# EAGLE design Cypher - V0.3.1 (EAGLE 9.0.1)
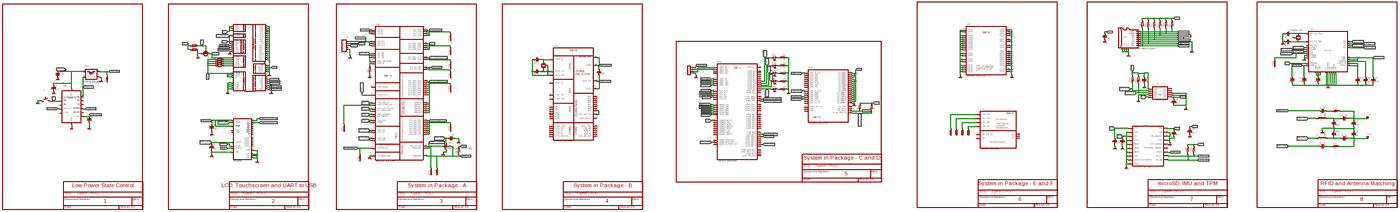
[diagram p0: schematic, sheet 1, overview]
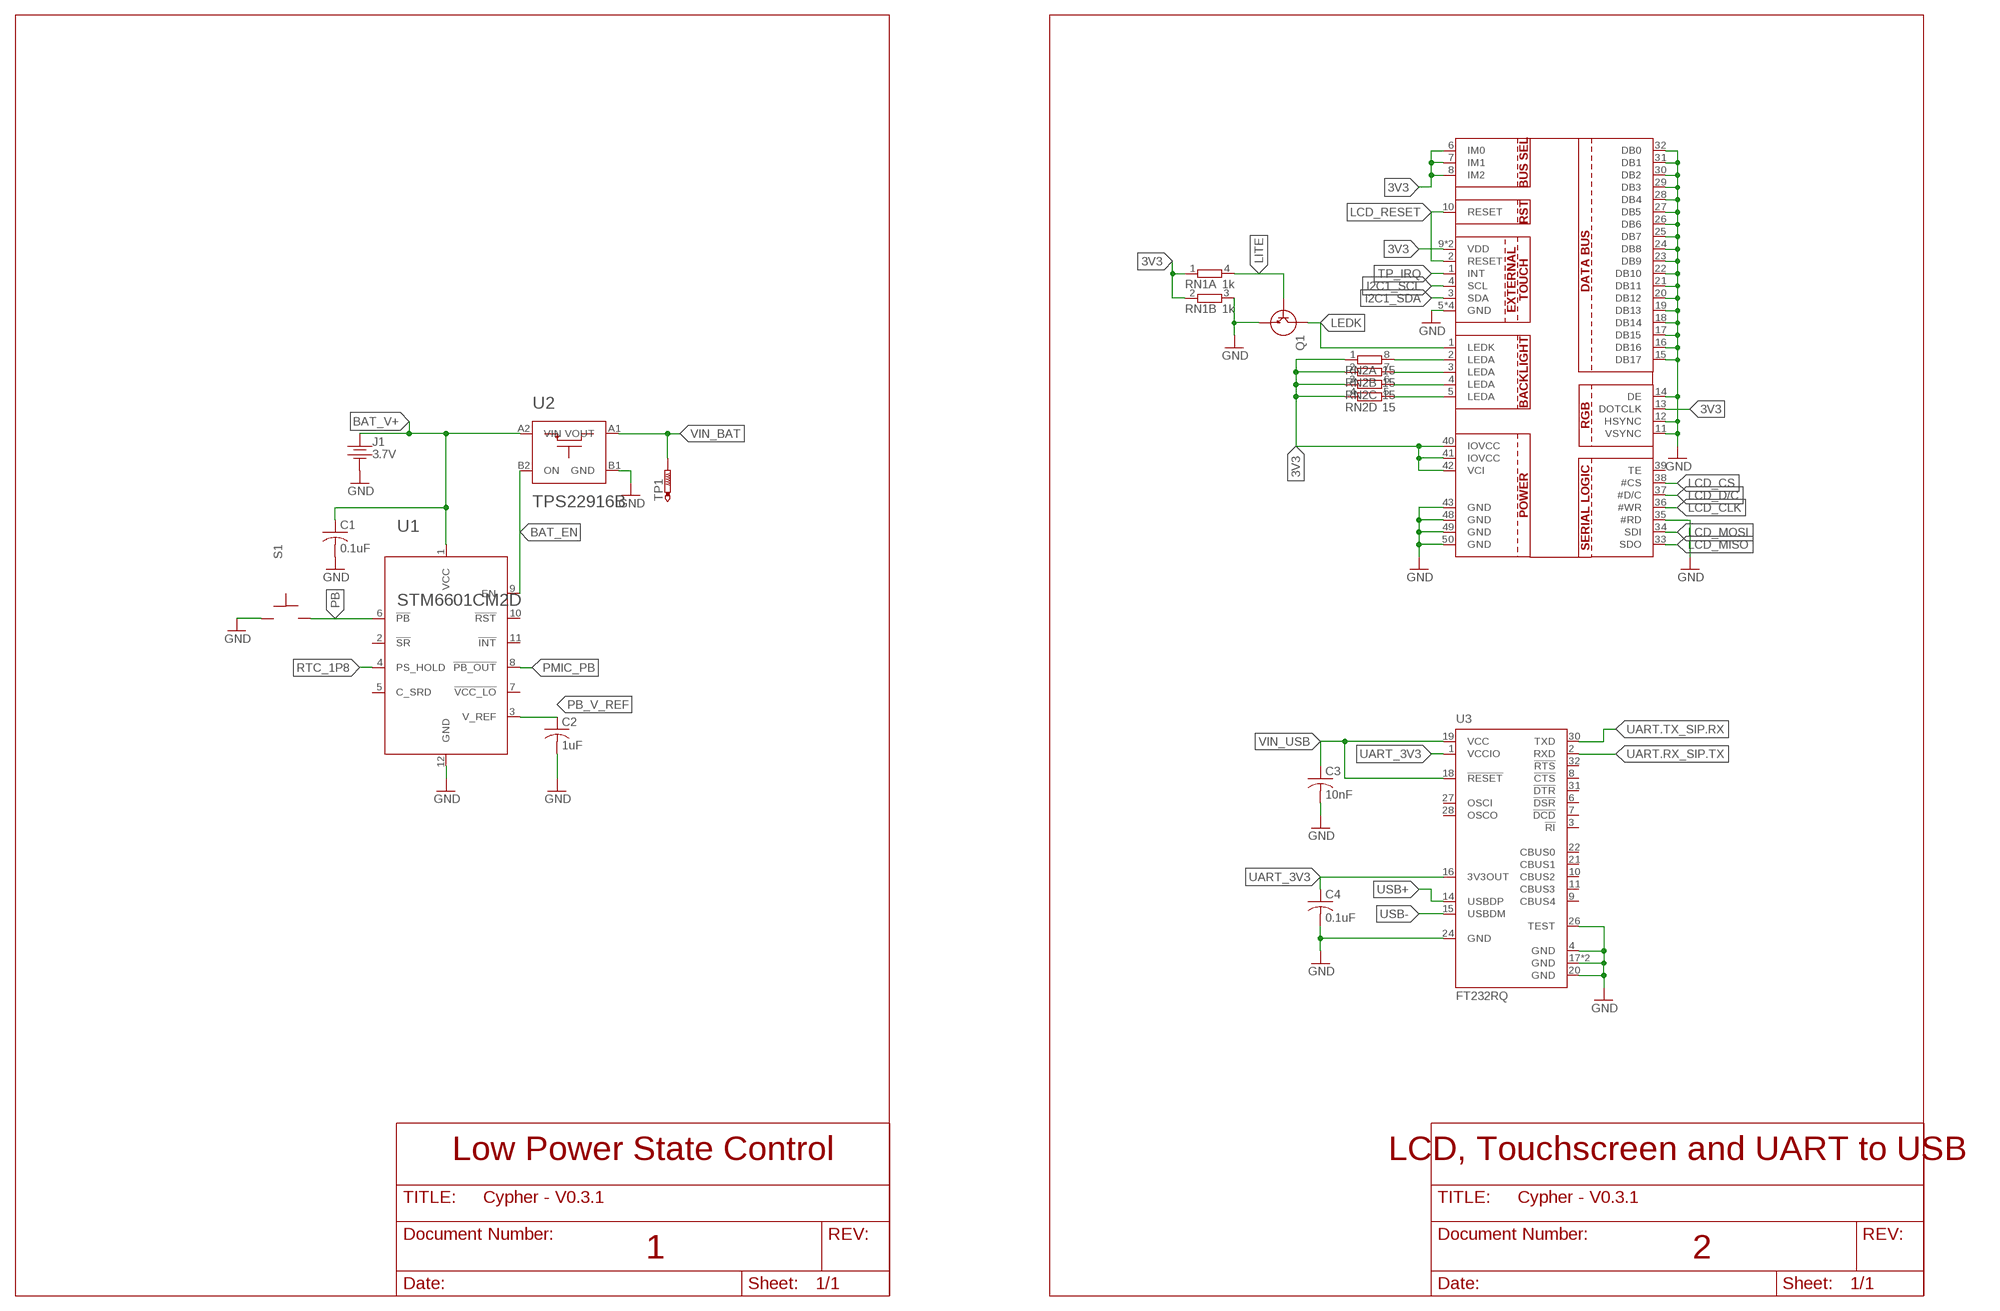
[diagram p1: schematic, sheet 1, part 1 of 5]
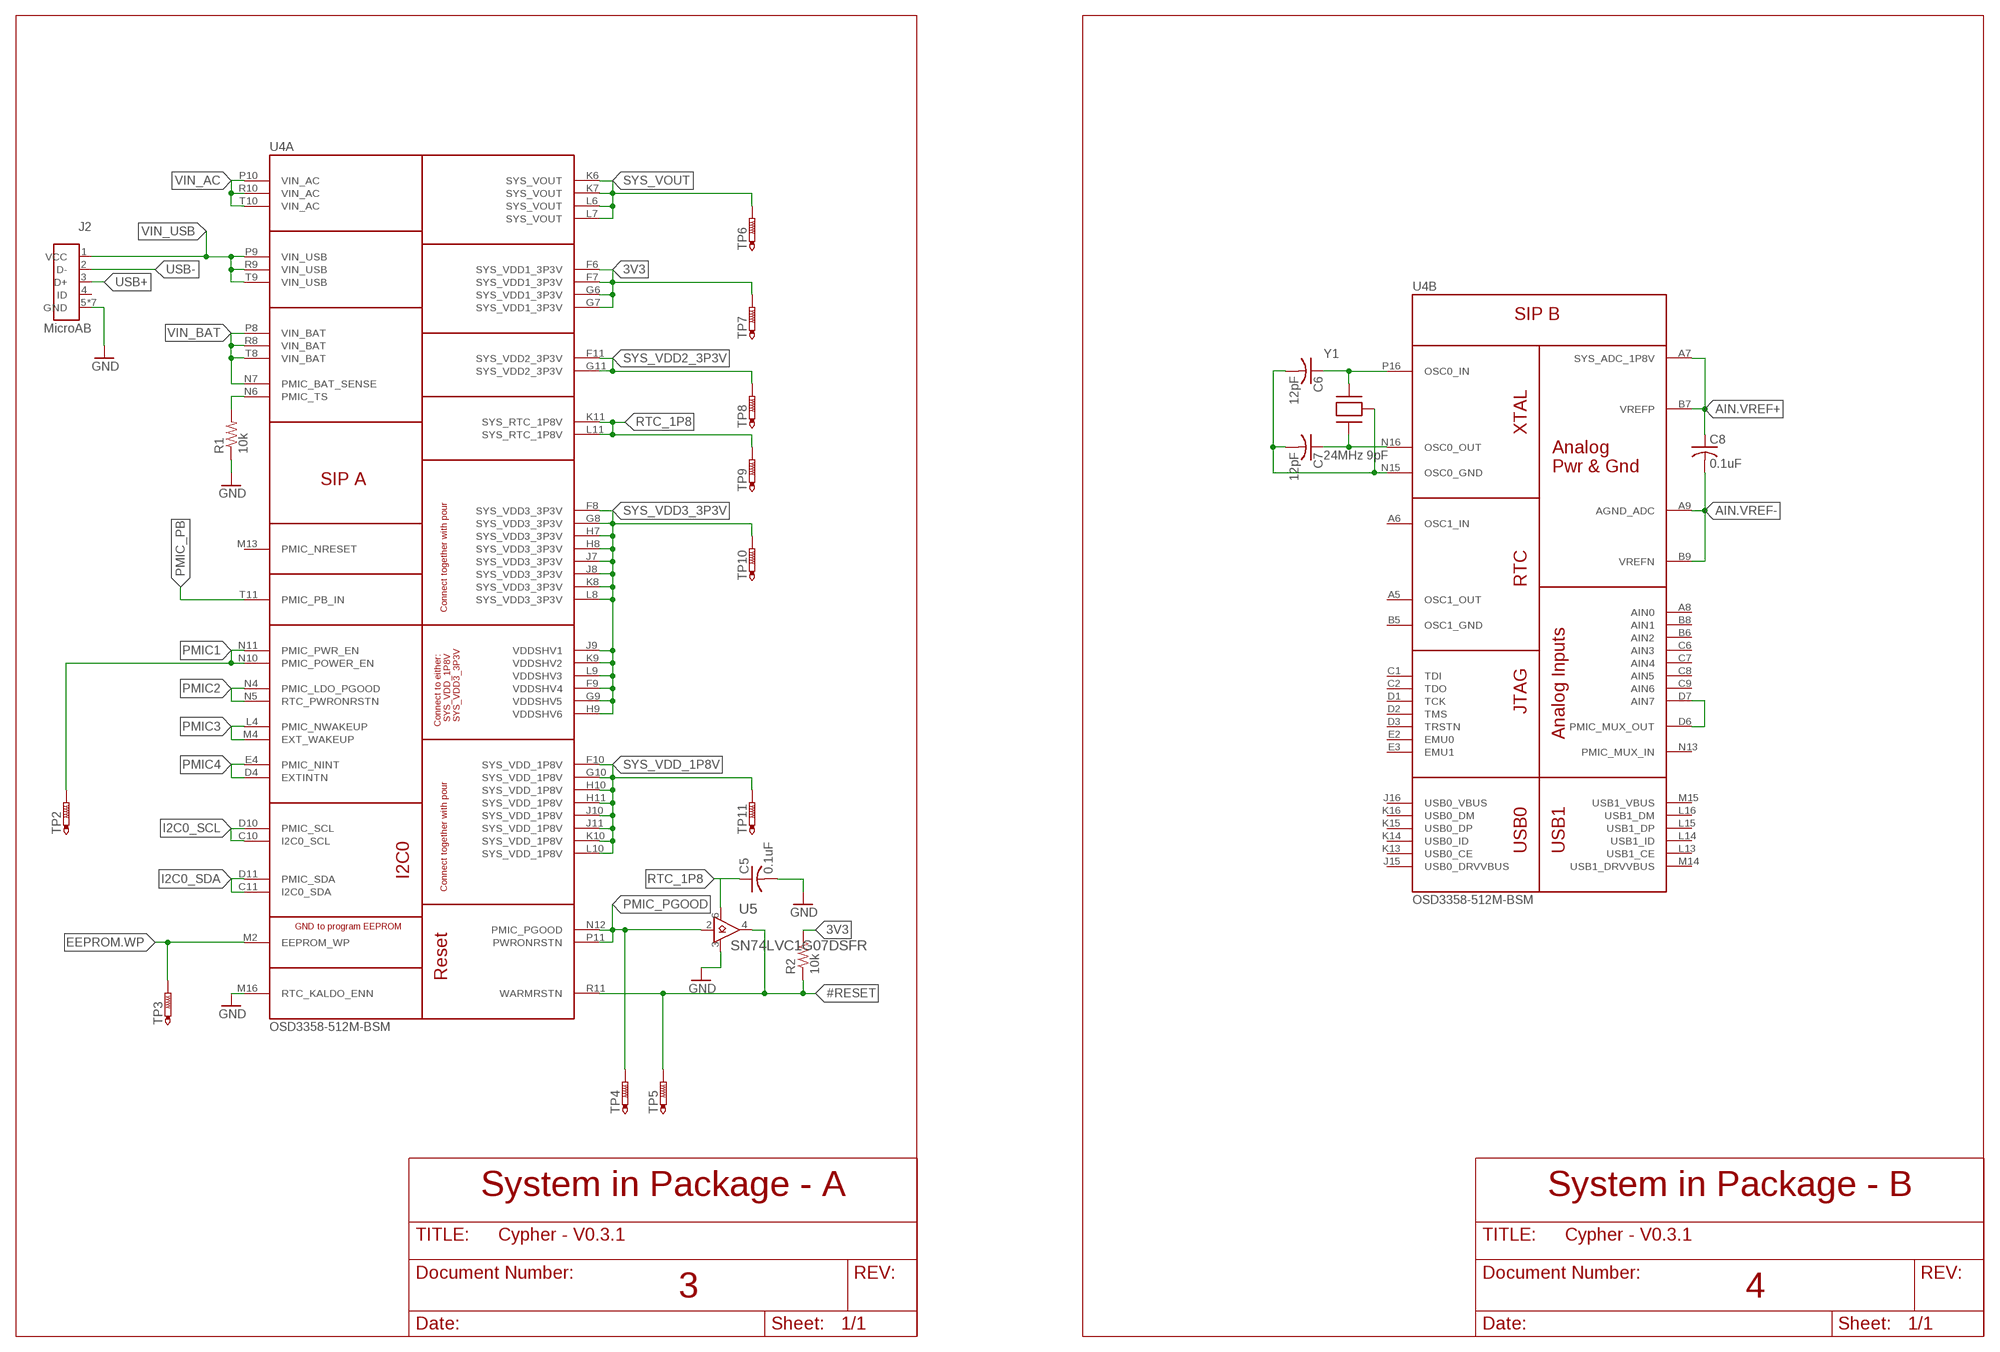
[diagram p2: schematic, sheet 1, part 2 of 5]
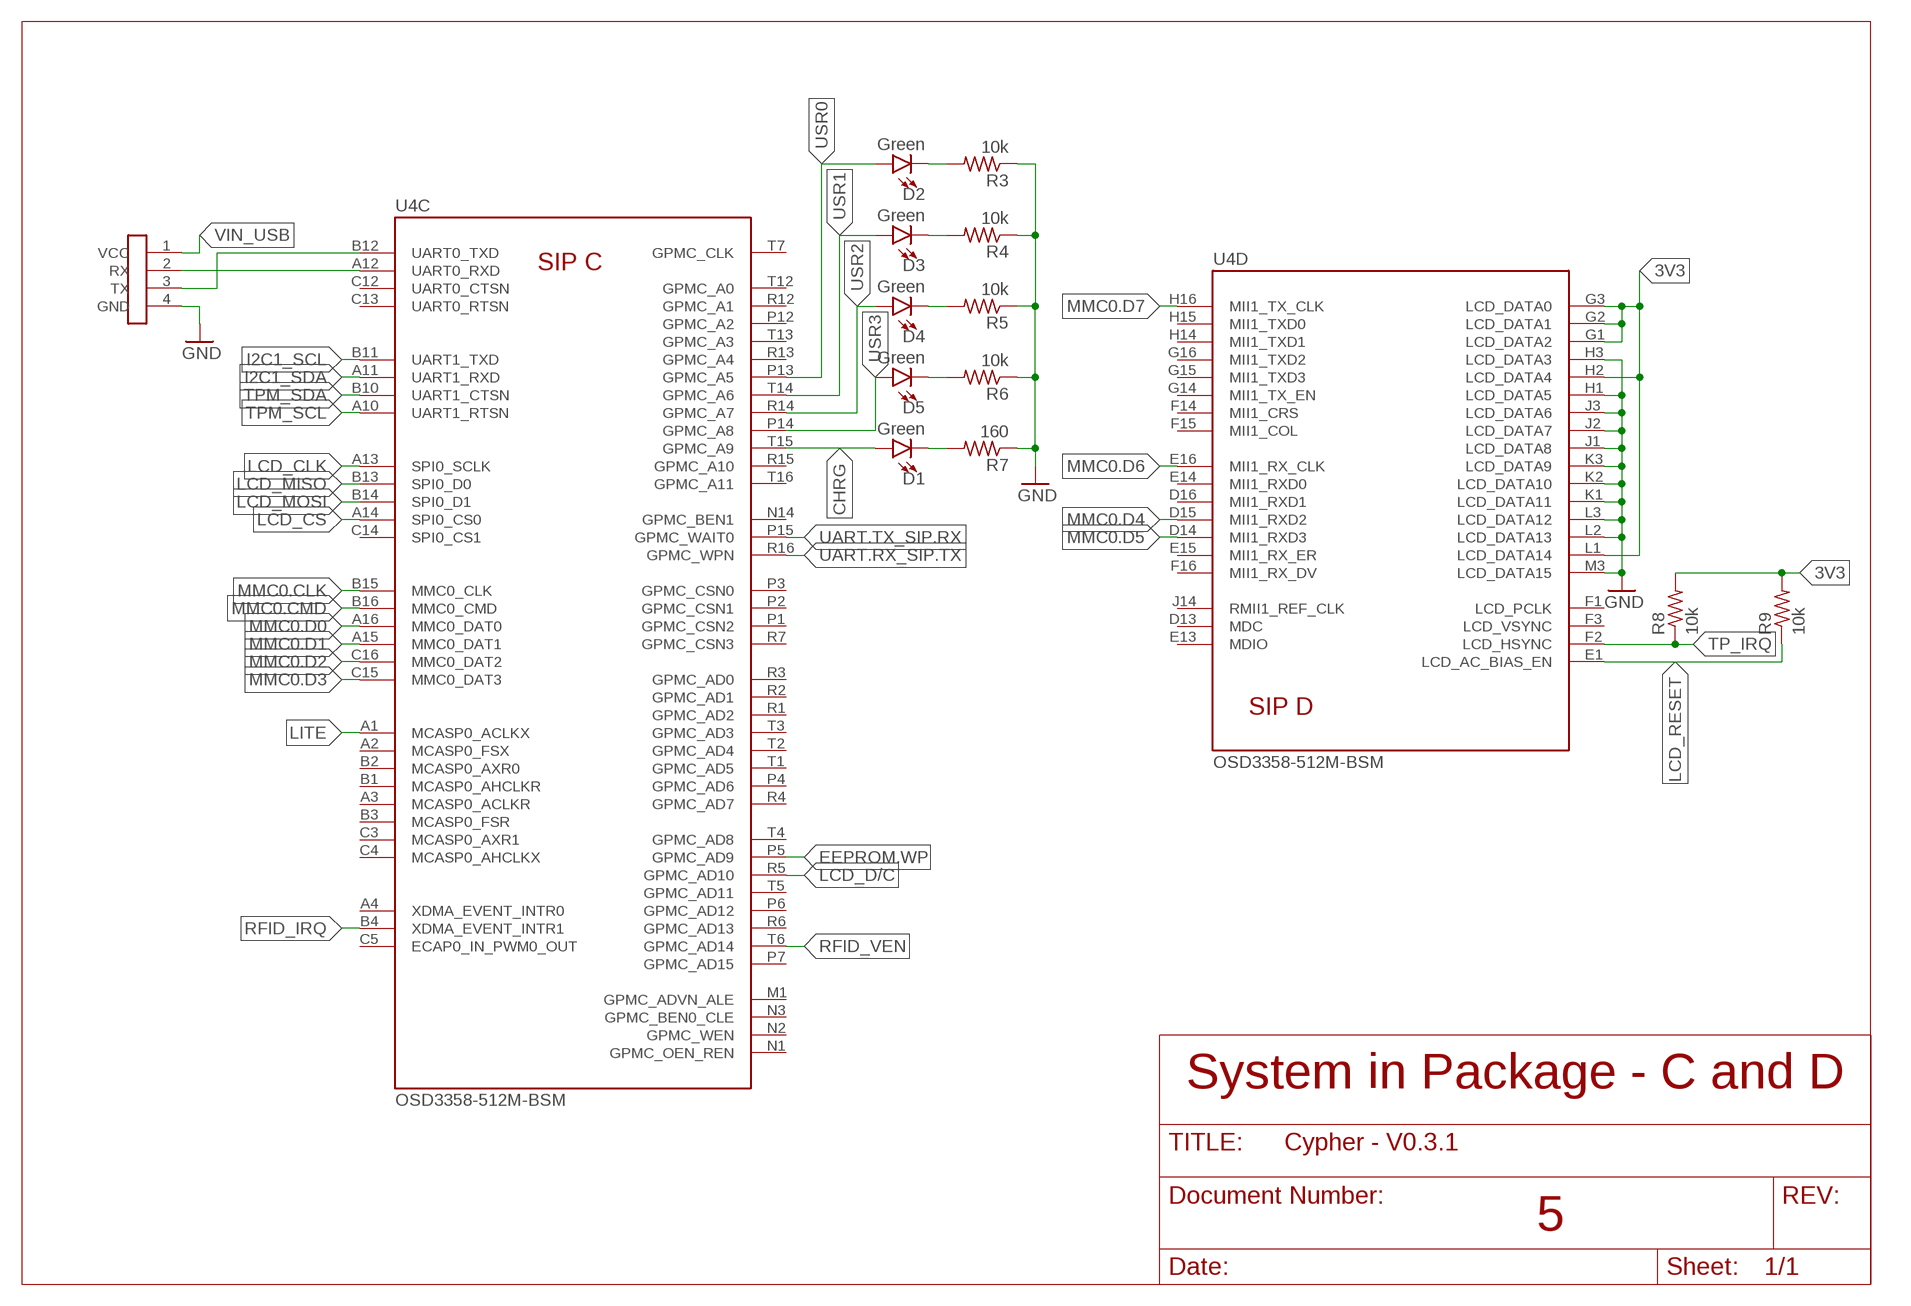
[diagram p3: schematic, sheet 1, part 3 of 5]
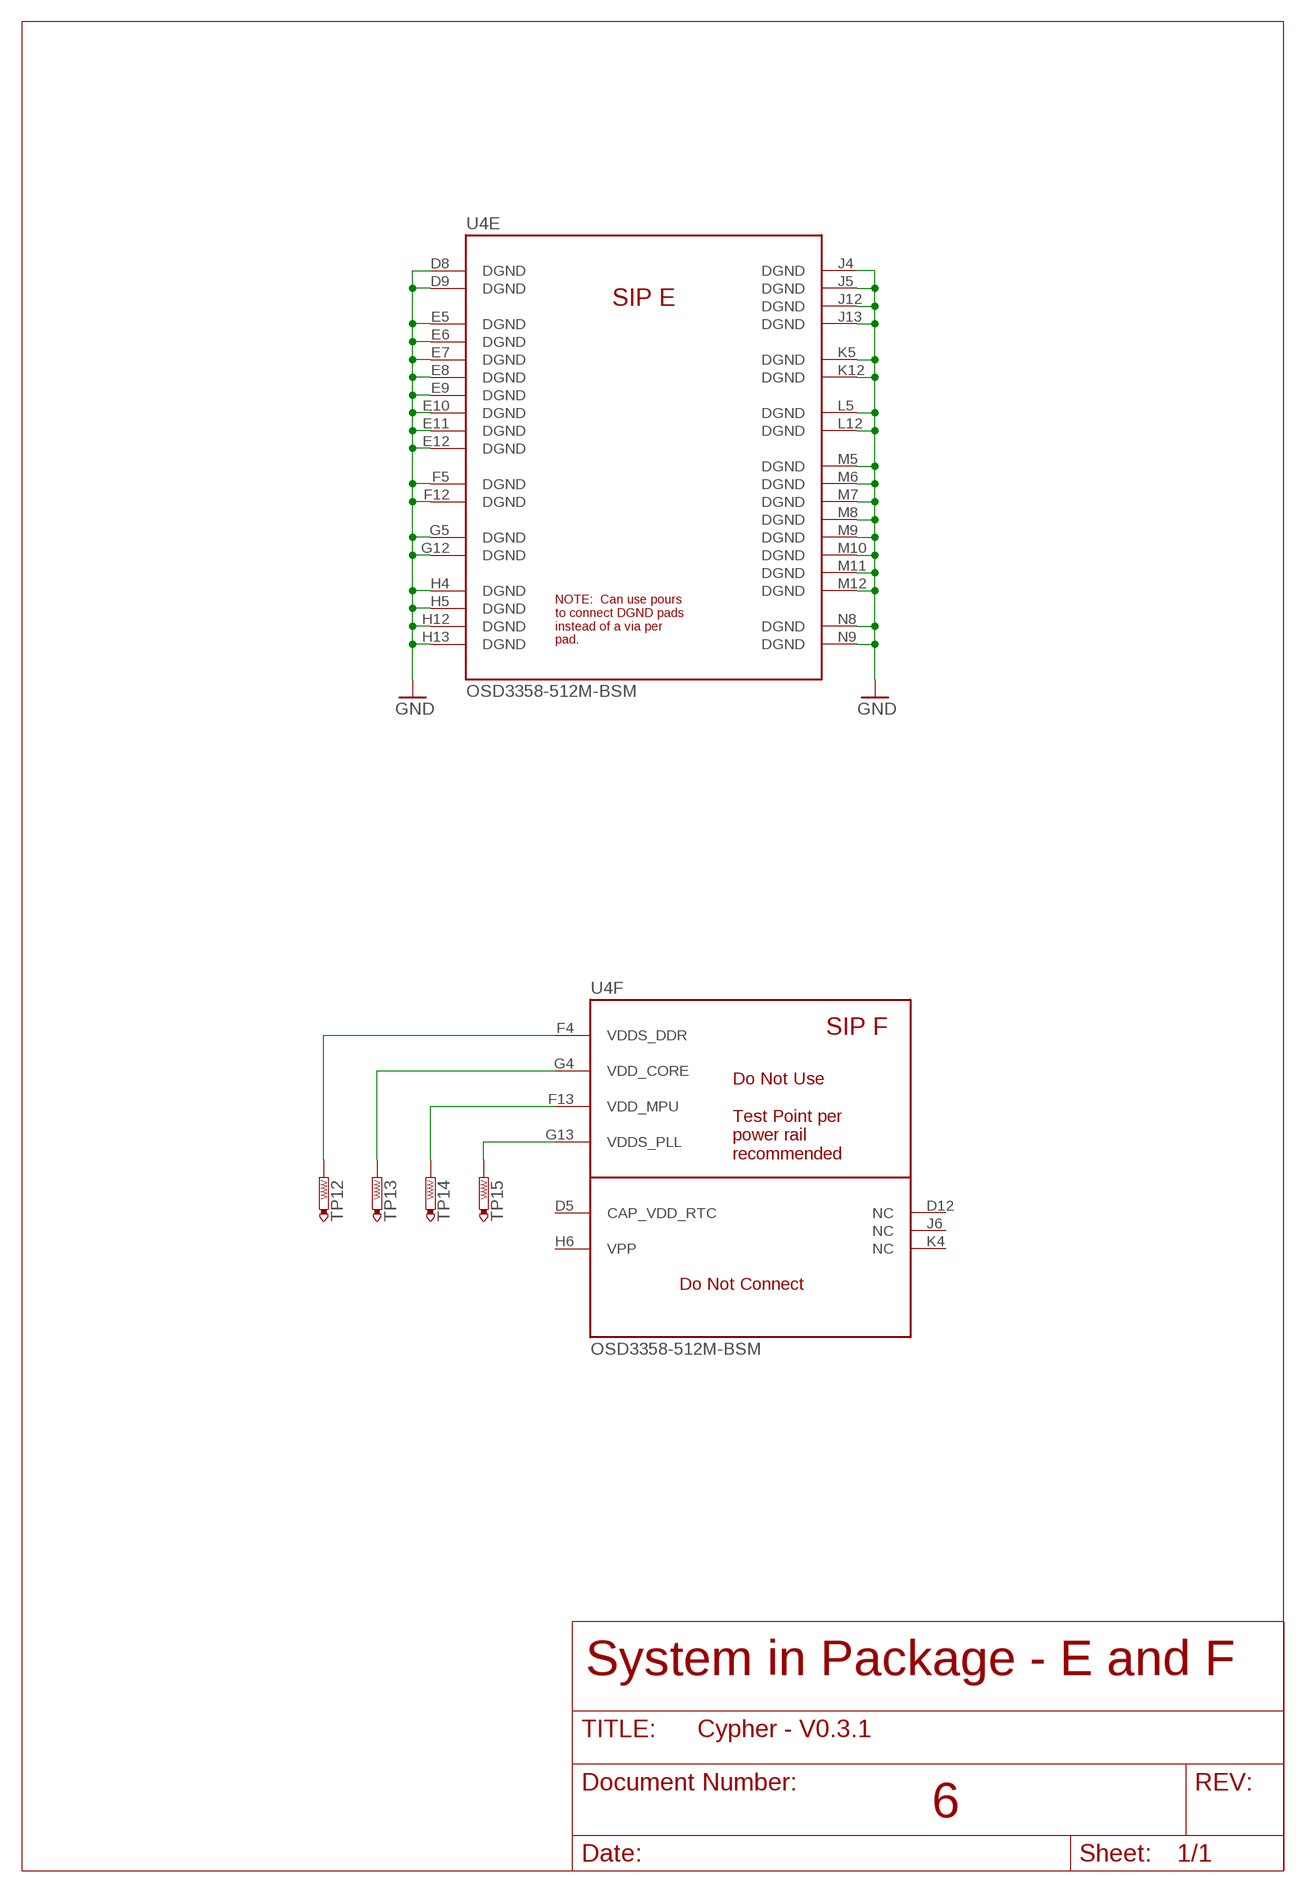
[diagram p4: schematic, sheet 1, part 4 of 5]
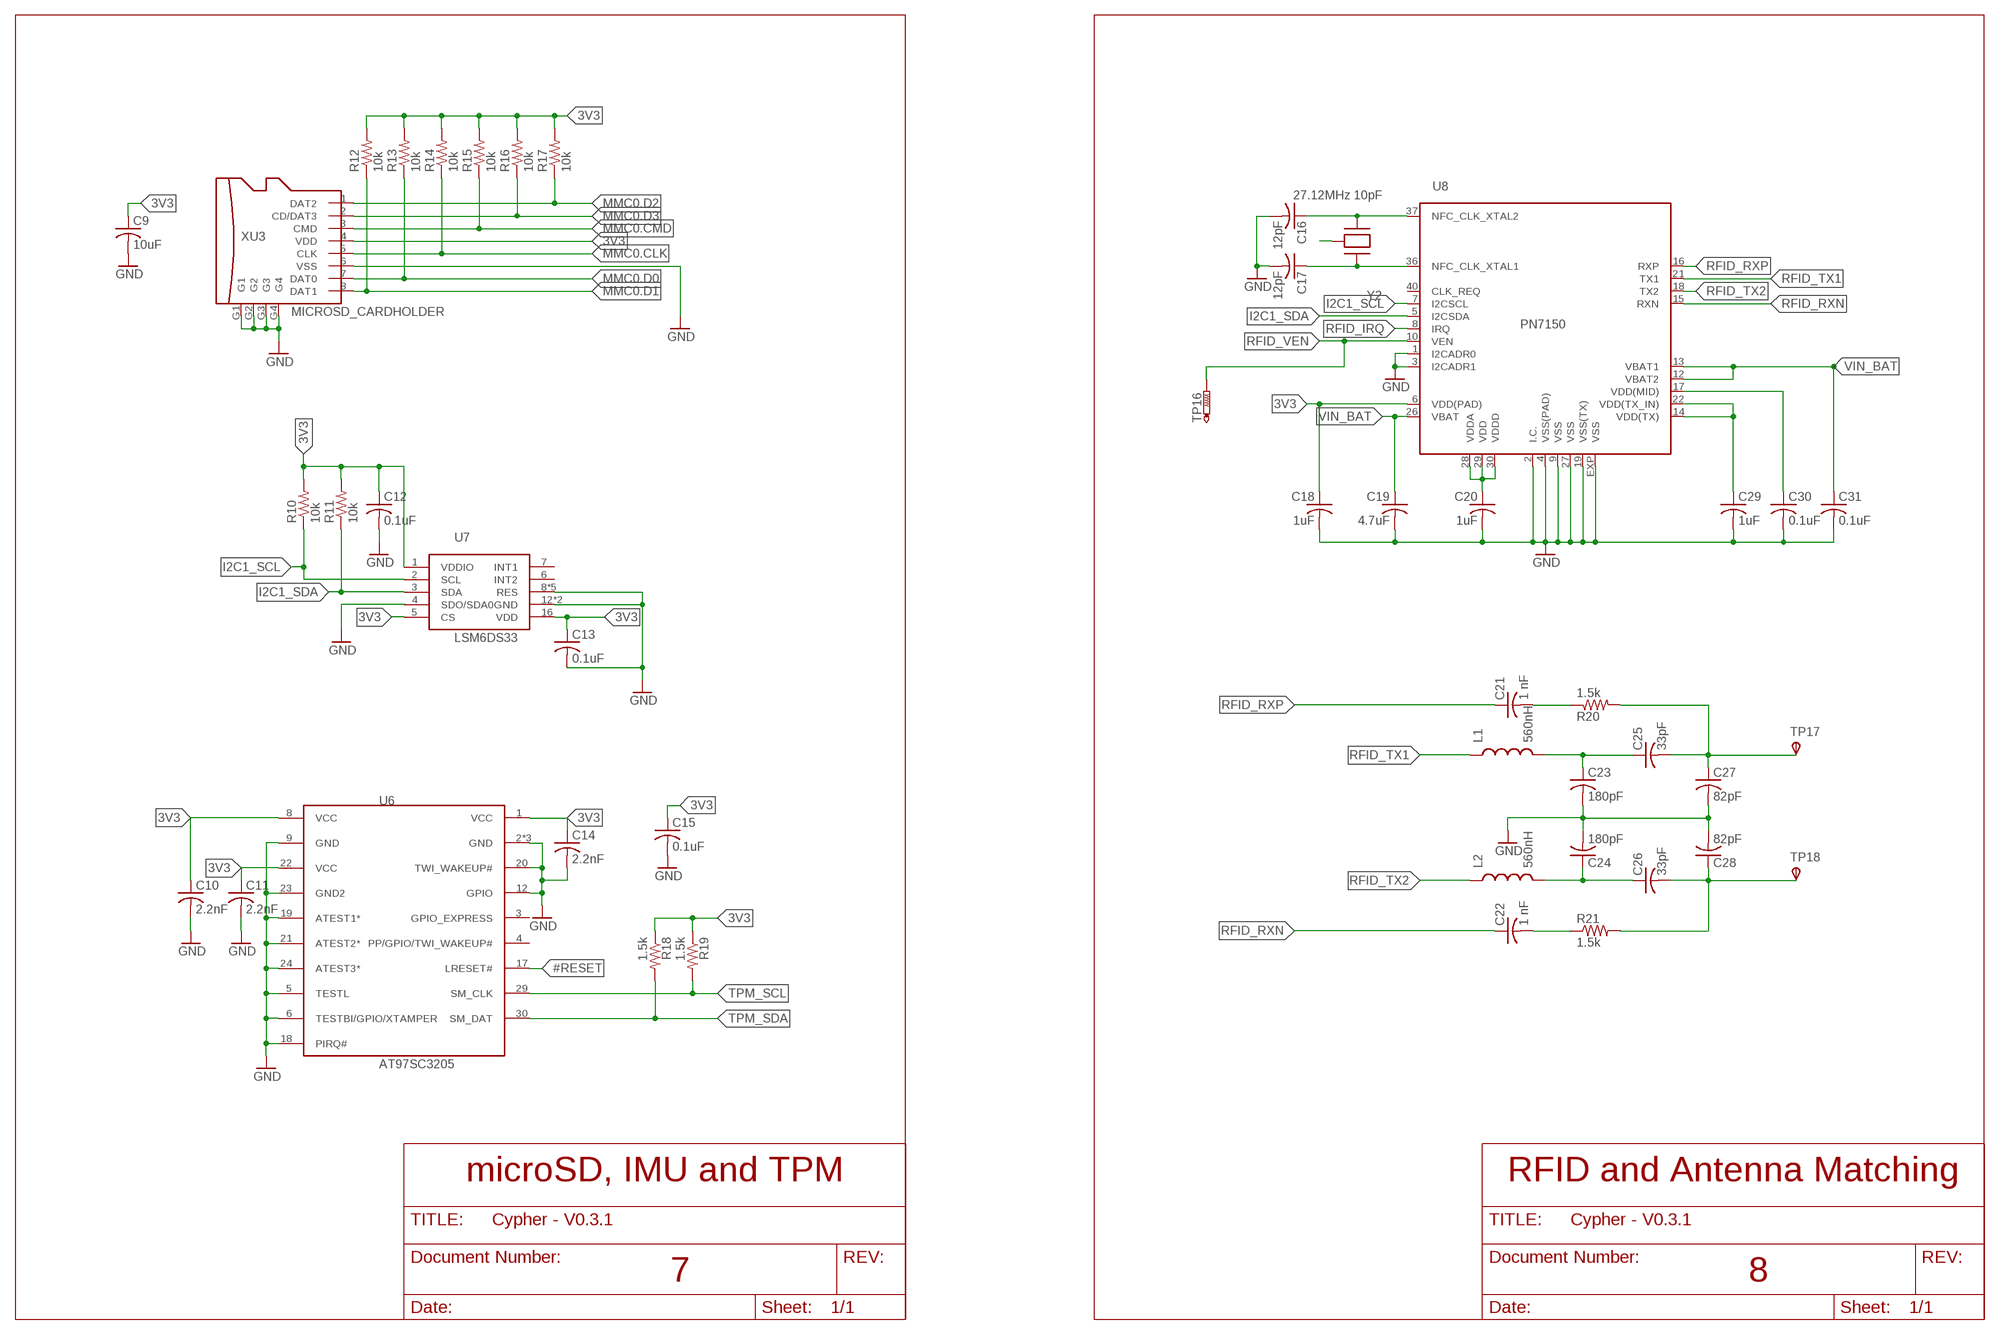
[diagram p5: schematic, sheet 1, part 5 of 5]

## Parts
C1  0.1uF  C-USC0402  [C0402]
C2  1uF  C-USC0402  [C0402]
C3  10nF  C-USC0402  [C0402]
C4  0.1uF  C-USC0402  [C0402]
C5  0.1uF  C-USC0402  [C0402]
C6  12pF  C-USC0402  [C0402]
C7  12pF  C-USC0402  [C0402]
C8  0.1uF  C-USC0402  [C0402]
C9  10uF  C-USC0402  [C0402]
C10  2.2nF  C-USC0402  [C0402]
C11  2.2nF  C-USC0402  [C0402]
C12  0.1uF  C-USC0402  [C0402]
C13  0.1uF  C-USC0402  [C0402]
C14  2.2nF  C-USC0402  [C0402]
C15  0.1uF  C-USC0402  [C0402]
C16  12pF  C-USC0402  [C0402]
C17  12pF  C-USC0402  [C0402]
C18  1uF  C-USC0402  [C0402]
C19  4.7uF  C-USC0402  [C0402]
C20  1uF  C-USC0402  [C0402]
C21  1 nF  C-USC0603  [C0603]
C22  1 nF  C-USC0603  [C0603]
C23  180pF  C-USC0402  [C0402]
C24  180pF  C-USC0402  [C0402]
C25  33pF  C-USC0402  [C0402]
C26  33pF  C-USC0402  [C0402]
C27  82pF  C-USC0402  [C0402]
C28  82pF  C-USC0402  [C0402]
C29  1uF  C-USC0402  [C0402]
C30  0.1uF  C-USC0402  [C0402]
C31  0.1uF  C-USC0402  [C0402]
D1  Green  LED0603  [LED-0603]
D2  Green  LED0603  [LED-0603]
D3  Green  LED0603  [LED-0603]
D4  Green  LED0603  [LED-0603]
D5  Green  LED0603  [LED-0603]
J1  3.7V  SH-CONNECTOR  [SH_CONNECTOR]
J2  MicroAB  MICRO_USB_AB_SMD  [MICRO-USB-AB-SMD]
J3  UARTPINSSH  [SM04B-SRSS-TB]
L1  560nH  INDUCTOR0402  [C0402]
L2  560nH  INDUCTOR0402  [C0402]
Q1  MMBT2222ASOT23  [SOT-23-3]
R1  10k  R-US_R0402  [R0402]
R2  10k  R-US_R0402  [R0402]
R3  10k  R-US_R0402  [R0402]
R4  10k  R-US_R0402  [R0402]
R5  10k  R-US_R0402  [R0402]
R6  10k  R-US_R0402  [R0402]
R7  160  R-US_R0402  [R0402]
R8  10k  R-US_R0402  [R0402]
R9  10k  R-US_R0402  [R0402]
R10  10k  R-US_R0402  [R0402]
R11  10k  R-US_R0402  [R0402]
R12  10k  R-US_R0402  [R0402]
R13  10k  R-US_R0402  [R0402]
R14  10k  R-US_R0402  [R0402]
R15  10k  R-US_R0402  [R0402]
R16  10k  R-US_R0402  [R0402]
R17  10k  R-US_R0402  [R0402]
R18  1.5k  R-US_R0402  [R0402]
R19  1.5k  R-US_R0402  [R0402]
R20  1.5k  R-US_R0402  [R0402]
R21  1.5k  R-US_R0402  [R0402]
RN1  1k  2R-NEXBV4V  [EXBV4V]
RN2  15  4R-NEXBN8V  [EXBN8V]
S1  PUSHBUTTON1.2  [EVQ-PUK]
TP1  PTR1B1,27  [B1,27]
TP2  PTR1B1,27  [B1,27]
TP3  PTR1B1,27  [B1,27]
TP4  PTR1B1,27  [B1,27]
TP5  PTR1B1,27  [B1,27]
TP6  PTR1B1,27  [B1,27]
TP7  PTR1B1,27  [B1,27]
TP8  PTR1B1,27  [B1,27]
TP9  PTR1B1,27  [B1,27]
TP10  PTR1B1,27  [B1,27]
TP11  PTR1B1,27  [B1,27]
TP12  PTR1B1,27  [B1,27]
TP13  PTR1B1,27  [B1,27]
TP14  PTR1B1,27  [B1,27]
TP15  PTR1B1,27  [B1,27]
TP16  PTR1B1,27  [B1,27]
TP17  TPSB2,54  [B2,54]
TP18  TPSB2,54  [B2,54]
U1  STM6601CM2D  STM660  [TDFN12]
U2  TPS22916B  [WSON-4PIN]
U3  FT232RQ  [QFN32]
U4  OSD3358-512M-BSM  [OSD335X-BGA-256]
U5  SN74LVC1G07DSFR  [SON35P100X100X40-6N]
U6  AT97SC3205  [QFN32-4MM]
U7  LSM6DS33  [LGA-16]
U8  PN7150  [HVQFN40]
XU1  CAPTOUCHSCREEN_6PINFPC10PIN  [DF37NB-10DS-0.4V]
XU2  ILI9388_50PIN_SOCKET  [FPC/FFC_50PIN_0.5MMPITCH]
XU3  MICROSD_CARDHOLDER  [HINGED_LID_MICROSD]
Y1  24MHz 9pF  TSX-3225  [4-SMD]
Y2  27.12MHz 10pF  CRISTAL_XRCGB  [XRCGB]

## Nets
3V3: C9.1 C10.1 C11.1 C12.1 C13.1 C14.1 C15.1 C18.1 R2.2 R8.2 R9.2 R10.2 R11.2 R12.2 R13.2 R14.2 R15.2 R16.2 R17.2 R18.1 R19.1 RN1.1 RN1.2 RN2.1 RN2.2 RN2.3 RN2.4 TP7.TP U4.F6(A:SYS_VDD1_3P3V) U4.F7(A:SYS_VDD1_3P3V) U4.G1(D:LCD_DATA2) U4.G2(D:LCD_DATA1) U4.G3(D:LCD_DATA0) U4.G6(A:SYS_VDD1_3P3V) U4.G7(A:SYS_VDD1_3P3V) U4.H2(D:LCD_DATA4) U4.L1(D:LCD_DATA14) U6.1(VCC) U6.8(VCC) U6.22(VCC) U7.1(VDDIO) U7.5(CS) U7.16(VDD) U8.6(VDD(PAD)) XU1.9(VDD) XU1.10(VDD) XU2.6(IM0) XU2.7(IM1) XU2.8(IM2) XU2.13(DOTCLK) XU2.40(IOVCC) XU2.41(IOVCC) XU2.42(VCI) XU3.4(VDD)
#RESET: R2.1 TP5.TP U4.R11(A:WARMRSTN) U5.4(Y) U6.17(LRESET#)
AIN.VREF+: C8.1 U4.A7(B:SYS_ADC_1P8V) U4.B7(B:VREFP)
AIN.VREF-: C8.2 U4.A9(B:AGND_ADC) U4.B9(B:VREFN)
ANT_1: C25.2 C27.1 R20.2 TP17.TP(PP)
ANT_2: C26.2 C28.1 R21.2 TP18.TP(PP)
BAT_EN: U1.9(EN) U2.B2(ON)
BAT_V+: C1.1 J1.2(V+) U1.1(VCC) U2.A2(VIN)
CHRG: D1.A U4.T15(C:GPMC_A9)
D2_CAT: D2.C R3.2
D2_CAT1: D1.C R7.2
D3_CAT: D3.C R4.2
D4_CAT: D4.C R5.2
D5_CAT: D5.C R6.2
EEPROM.WP: TP3.TP U4.M2(A:EEPROM_WP) U4.P5(C:GPMC_AD9)
EMCF_ANTM1: C23.1 C25.1 L1.2
EMCF_ANTM2: C24.1 C26.1 L2.2
GND: C1.2 C2.2 C3.2 C4.2 C5.2 C9.2 C10.2 C11.2 C12.2 C13.2 C14.2 C15.2 C16.2 C17.2 C18.2 C19.2 C20.2 C23.2 C24.2 C27.2 C28.2 C29.2 C30.2 C31.2 J1.1(V-) J2.5(GND) J2.PAD1(GND) J2.PAD2(GND) J2.PAD3(GND) J2.PAD4(GND) J2.PAD5(GND) J2.PAD6(GND) J3.4(GND) Q1.E R1.1 R3.1 R4.1 R5.1 R6.1 R7.1 RN1.3 S1.2 S1.4 U1.12(GND) U2.B1(GND) U3.4(GND) U3.17(GND) U3.20(GND) U3.24(GND) U3.26(TEST) U3.EXP(GND) U4.D8(E:DGND) U4.D9(E:DGND) U4.E5(E:DGND) U4.E6(E:DGND) U4.E7(E:DGND) U4.E8(E:DGND) U4.E9(E:DGND) U4.E10(E:DGND) U4.E11(E:DGND) U4.E12(E:DGND) U4.F5(E:DGND) U4.F12(E:DGND) U4.G5(E:DGND) U4.G12(E:DGND) U4.H1(D:LCD_DATA5) U4.H3(D:LCD_DATA3) U4.H4(E:DGND) U4.H5(E:DGND) U4.H12(E:DGND) U4.H13(E:DGND) U4.J1(D:LCD_DATA8) U4.J2(D:LCD_DATA7) U4.J3(D:LCD_DATA6) U4.J4(E:DGND) U4.J5(E:DGND) U4.J12(E:DGND) U4.J13(E:DGND) U4.K1(D:LCD_DATA11) U4.K2(D:LCD_DATA10) U4.K3(D:LCD_DATA9) U4.K5(E:DGND) U4.K12(E:DGND) U4.L2(D:LCD_DATA13) U4.L3(D:LCD_DATA12) U4.L5(E:DGND) U4.L12(E:DGND) U4.M3(D:LCD_DATA15) U4.M5(E:DGND) U4.M6(E:DGND) U4.M7(E:DGND) U4.M8(E:DGND) U4.M9(E:DGND) U4.M10(E:DGND) U4.M11(E:DGND) U4.M12(E:DGND) U4.M16(A:RTC_KALDO_ENN) U4.N8(E:DGND) U4.N9(E:DGND) U5.3(GND) U6.2(GND) U6.5(TESTL) U6.6(TESTBI/GPIO/XTAMPER) U6.9(GND) U6.12(GPIO) U6.18(PIRQ#) U6.19(ATEST1*) U6.20(TWI_WAKEUP#) U6.21(ATEST2*) U6.23(GND2) U6.24(ATEST3*) U6.32(GND) U6.EXP(GND) U7.4(SDO/SDA0) U7.8(RES) U7.9(RES) U7.10(RES) U7.11(RES) U7.12(GND) U7.13(GND) U7.15(RES) U8.1(I2CADR0) U8.2(I.C.) U8.3(I2CADR1) U8.4(VSS(PAD)) U8.9(VSS) U8.19(VSS(TX)) U8.27(VSS) U8.EXP(VSS) XU1.5(GND) XU1.6(GND) XU1.7(GND) XU1.8(GND) XU2.11(VSYNC) XU2.12(HSYNC) XU2.14(DE) XU2.15(DB17) XU2.16(DB16) XU2.17(DB15) XU2.18(DB14) XU2.19(DB13) XU2.20(DB12) XU2.21(DB11) XU2.22(DB10) XU2.23(DB9) XU2.24(DB8) XU2.25(DB7) XU2.26(DB6) XU2.27(DB5) XU2.28(DB4) XU2.29(DB3) XU2.30(DB2) XU2.31(DB1) XU2.32(DB0) XU2.35(#RD) XU2.43(GND) XU2.48(GND) XU2.49(GND) XU2.50(GND) XU3.6(VSS) XU3.G1 XU3.G2 XU3.G3 XU3.G4
I2C0_SCL: U4.C10(A:I2C0_SCL) U4.D10(A:PMIC_SCL)
I2C0_SDA: U4.C11(A:I2C0_SDA) U4.D11(A:PMIC_SDA)
I2C1_SCL: R10.1 U4.B11(C:UART1_TXD) U7.2(SCL) U8.7(I2CSCL) XU1.4(SCL)
I2C1_SDA: R11.1 U4.A11(C:UART1_RXD) U7.3(SDA) U8.5(I2CSDA) XU1.3(SDA)
LCD_CLK: U4.A13(C:SPI0_SCLK) XU2.36(#WR)
LCD_CS: U4.A14(C:SPI0_CS0) XU2.38(#CS)
LCD_D/C: U4.R5(C:GPMC_AD10) XU2.37(#D/C)
LCD_MISO: U4.B13(C:SPI0_D0) XU2.33(SDO)
LCD_MOSI: U4.B14(C:SPI0_D1) XU2.34(SDI)
LCD_RESET: R9.1 U4.E1(D:LCD_AC_BIAS_EN) XU1.2(RESET) XU2.10(RESET)
LEDA@2: RN2.8 XU2.2(LEDA)
LEDA@3: RN2.7 XU2.3(LEDA)
LEDA@4: RN2.6 XU2.4(LEDA)
LEDA@5: RN2.5 XU2.5(LEDA)
LEDK: Q1.C XU2.1(LEDK)
LITE: Q1.B RN1.4 U4.A1(C:MCASP0_ACLKX)
MMC0.CLK: R14.1 U4.B15(C:MMC0_CLK) XU3.5(CLK)
MMC0.CMD: R15.1 U4.B16(C:MMC0_CMD) XU3.3(CMD)
MMC0.D0: R13.1 U4.A16(C:MMC0_DAT0) XU3.7(DAT0)
MMC0.D1: R12.1 U4.A15(C:MMC0_DAT1) XU3.8(DAT1)
MMC0.D2: R17.1 U4.C16(C:MMC0_DAT2) XU3.1(DAT2)
MMC0.D3: R16.1 U4.C15(C:MMC0_DAT3) XU3.2(CD/DAT3)
MMC0.D4: U4.D15(D:MII1_RXD2)
MMC0.D5: U4.D14(D:MII1_RXD3)
MMC0.D6: U4.E16(D:MII1_RX_CLK)
MMC0.D7: U4.H16(D:MII1_TX_CLK)
NC: Y2.2(GND) Y2.4(GND)
OSC_GND: C6.2 C7.2 U4.N15(B:OSC0_GND) Y1.2(GND) Y1.4(GND)
PB: S1.1 S1.3 U1.6(!PB)
PB_V_REF: C2.1 U1.3(V_REF)
PMIC1: TP2.TP U4.N10(A:PMIC_POWER_EN) U4.N11(A:PMIC_PWR_EN)
PMIC2: U4.N4(A:PMIC_LDO_PGOOD) U4.N5(A:RTC_PWRONRSTN)
PMIC3: U4.L4(A:PMIC_NWAKEUP) U4.M4(A:EXT_WAKEUP)
PMIC4: U4.D4(A:EXTINTN) U4.E4(A:PMIC_NINT)
PMIC_MUX: U4.D6(B:PMIC_MUX_OUT) U4.D7(B:AIN7)
PMIC_PB: U1.8(!PB_OUT) U4.T11(A:PMIC_PB_IN)
PMIC_PGOOD: TP4.TP U4.N12(A:PMIC_PGOOD) U4.P11(A:PWRONRSTN) U5.2(A)
PMIC_TS: R1.2 U4.N6(A:PMIC_TS)
RFID_IRQ: U4.B4(C:XDMA_EVENT_INTR1) U8.8(IRQ)
RFID_MISC_1: C21.2 R20.1
RFID_MISC_2: C22.2 R21.1
RFID_OSC_IN: C17.1 U8.36(NFC_CLK_XTAL1) Y2.1(OSC_IN)
RFID_OSC_OUT: C16.1 U8.37(NFC_CLK_XTAL2) Y2.3(OSC_OUT)
RFID_RXN: C22.1 U8.15(RXN)
RFID_RXP: C21.1 U8.16(RXP)
RFID_TX1: L1.1 U8.21(TX1)
RFID_TX2: L2.1 U8.18(TX2)
RFID_VEN: TP16.TP U4.T6(C:GPMC_AD14) U8.10(VEN)
RTC_1P8: C5.1 TP9.TP U1.4(PS_HOLD) U4.K11(A:SYS_RTC_1P8V) U4.L11(A:SYS_RTC_1P8V) U5.6(VCC)
SIP_OSC_IN: C6.1 U4.P16(B:OSC0_IN) Y1.1(OSC_IN)
SIP_OSC_OUT: C7.1 U4.N16(B:OSC0_OUT) Y1.3(OSC_OUT)
SYS_VDD2_3P3V: TP8.TP U4.F11(A:SYS_VDD2_3P3V) U4.G11(A:SYS_VDD2_3P3V)
SYS_VDD3_3P3V: TP10.TP U4.F8(A:SYS_VDD3_3P3V) U4.F9(A:VDDSHV4) U4.G8(A:SYS_VDD3_3P3V) U4.G9(A:VDDSHV5) U4.H7(A:SYS_VDD3_3P3V) U4.H8(A:SYS_VDD3_3P3V) U4.H9(A:VDDSHV6) U4.J7(A:SYS_VDD3_3P3V) U4.J8(A:SYS_VDD3_3P3V) U4.J9(A:VDDSHV1) U4.K8(A:SYS_VDD3_3P3V) U4.K9(A:VDDSHV2) U4.L8(A:SYS_VDD3_3P3V) U4.L9(A:VDDSHV3)
SYS_VDD_1P8V: TP11.TP U4.F10(A:SYS_VDD_1P8V) U4.G10(A:SYS_VDD_1P8V) U4.H10(A:SYS_VDD_1P8V) U4.H11(A:SYS_VDD_1P8V) U4.J10(A:SYS_VDD_1P8V) U4.J11(A:SYS_VDD_1P8V) U4.K10(A:SYS_VDD_1P8V) U4.L10(A:SYS_VDD_1P8V)
SYS_VOUT: TP6.TP U4.K6(A:SYS_VOUT) U4.K7(A:SYS_VOUT) U4.L6(A:SYS_VOUT) U4.L7(A:SYS_VOUT)
TP_IRQ: R8.1 U4.F2(D:LCD_HSYNC) XU1.1(INT)
TPM_SCL: R19.2 U4.A10(C:UART1_RTSN) U6.29(SM_CLK)
TPM_SDA: R18.2 U4.B10(C:UART1_CTSN) U6.30(SM_DAT)
UART0_RX: J3.2(RX) U4.A12(C:UART0_RXD)
UART0_TX: J3.3(TX) U4.B12(C:UART0_TXD)
UART.RX_SIP.TX: U3.2(RXD) U4.R16(C:GPMC_WPN)
UART.TX_SIP.RX: U3.30(TXD) U4.P15(C:GPMC_WAIT0)
UART_3V3: C4.1 U3.1(VCCIO) U3.16(3V3OUT)
USB+: J2.3(D+) U3.14(USBDP)
USB-: J2.2(D-) U3.15(USBDM)
USR0: D2.A U4.P13(C:GPMC_A5)
USR1: D3.A U4.T14(C:GPMC_A6)
USR2: D4.A U4.R14(C:GPMC_A7)
USR3: D5.A U4.P14(C:GPMC_A8)
VDD: C20.1 U8.28(VDDA) U8.29(VDD) U8.30(VDDD)
VDD(MID): C30.1 U8.17(VDD(MID))
VDD(TX): C29.1 U8.14(VDD(TX)) U8.22(VDD(TX_IN))
VDD_CORE: TP13.TP U4.G4(F:VDD_CORE)
VDD_MPU: TP14.TP U4.F13(F:VDD_MPU)
VDDS_DDR: TP12.TP U4.F4(F:VDDS_DDR)
VDDS_PLL: TP15.TP U4.G13(F:VDDS_PLL)
VIN_AC: U4.P10(A:VIN_AC) U4.R10(A:VIN_AC) U4.T10(A:VIN_AC)
VIN_BAT: C19.1 C31.1 TP1.TP U2.A1(VOUT) U4.N7(A:PMIC_BAT_SENSE) U4.P8(A:VIN_BAT) U4.R8(A:VIN_BAT) U4.T8(A:VIN_BAT) U8.12(VBAT2) U8.13(VBAT1) U8.26(VBAT)
VIN_USB: C3.1 J2.1(VCC) J3.1(VCC) U3.18(!RESET) U3.19(VCC) U4.P9(A:VIN_USB) U4.R9(A:VIN_USB) U4.T9(A:VIN_USB)
Unconnected: J2.4(ID) U1.2(!SR) U1.5(C_SRD) U1.7(!VCC_LO) U1.10(!RST) U1.11(!INT) U3.3(!RI) U3.6(!DSR) U3.7(!DCD) U3.8(!CTS) U3.9(CBUS4) U3.10(CBUS2) U3.11(CBUS3) U3.21(CBUS1) U3.22(CBUS0) U3.27(OSCI) U3.28(OSCO) U3.31(!DTR) U3.32(!RTS) U4.A2(C:MCASP0_FSX) U4.A3(C:MCASP0_ACLKR) U4.A4(C:XDMA_EVENT_INTR0) U4.A5(B:OSC1_OUT) U4.A6(B:OSC1_IN) U4.A8(B:AIN0) U4.B1(C:MCASP0_AHCLKR) U4.B2(C:MCASP0_AXR0) U4.B3(C:MCASP0_FSR) U4.B5(B:OSC1_GND) U4.B6(B:AIN2) U4.B8(B:AIN1) U4.C1(B:TDI) U4.C2(B:TDO) U4.C3(C:MCASP0_AXR1) U4.C4(C:MCASP0_AHCLKX) U4.C5(C:ECAP0_IN_PWM0_OUT) U4.C6(B:AIN3) U4.C7(B:AIN4) U4.C8(B:AIN5) U4.C9(B:AIN6) U4.C12(C:UART0_CTSN) U4.C13(C:UART0_RTSN) U4.C14(C:SPI0_CS1) U4.D1(B:TCK) U4.D2(B:TMS) U4.D3(B:TRSTN) U4.D5(F:CAP_VDD_RTC) U4.D12(F:NC) U4.D13(D:MDC) U4.D16(D:MII1_RXD1) U4.E2(B:EMU0) U4.E3(B:EMU1) U4.E13(D:MDIO) U4.E14(D:MII1_RXD0) U4.E15(D:MII1_RX_ER) U4.F1(D:LCD_PCLK) U4.F3(D:LCD_VSYNC) U4.F14(D:MII1_CRS) U4.F15(D:MII1_COL) U4.F16(D:MII1_RX_DV) U4.G14(D:MII1_TX_EN) U4.G15(D:MII1_TXD3) U4.G16(D:MII1_TXD2) U4.H6(F:VPP) U4.H14(D:MII1_TXD1) U4.H15(D:MII1_TXD0) U4.J6(F:NC) U4.J14(D:RMII1_REF_CLK) U4.J15(B:USB0_DRVVBUS) U4.J16(B:USB0_VBUS) U4.K4(F:NC) U4.K13(B:USB0_CE) U4.K14(B:USB0_ID) U4.K15(B:USB0_DP) U4.K16(B:USB0_DM) U4.L13(B:USB1_CE) U4.L14(B:USB1_ID) U4.L15(B:USB1_DP) U4.L16(B:USB1_DM) U4.M1(C:GPMC_ADVN_ALE) U4.M13(A:PMIC_NRESET) U4.M14(B:USB1_DRVVBUS) U4.M15(B:USB1_VBUS) U4.N1(C:GPMC_OEN_REN) U4.N2(C:GPMC_WEN) U4.N3(C:GPMC_BEN0_CLE) U4.N13(B:PMIC_MUX_IN) U4.N14(C:GPMC_BEN1) U4.P1(C:GPMC_CSN2) U4.P2(C:GPMC_CSN1) U4.P3(C:GPMC_CSN0) U4.P4(C:GPMC_AD6) U4.P6(C:GPMC_AD12) U4.P7(C:GPMC_AD15) U4.P12(C:GPMC_A2) U4.R1(C:GPMC_AD2) U4.R2(C:GPMC_AD1) U4.R3(C:GPMC_AD0) U4.R4(C:GPMC_AD7) U4.R6(C:GPMC_AD13) U4.R7(C:GPMC_CSN3) U4.R12(C:GPMC_A1) U4.R13(C:GPMC_A4) U4.R15(C:GPMC_A10) U4.T1(C:GPMC_AD5) U4.T2(C:GPMC_AD4) U4.T3(C:GPMC_AD3) U4.T4(C:GPMC_AD8) U4.T5(C:GPMC_AD11) U4.T7(C:GPMC_CLK) U4.T12(C:GPMC_A0) U4.T13(C:GPMC_A3) U4.T16(C:GPMC_A11) U5.1(N.C_2) U5.5(N.C) U6.3(GPIO_EXPRESS) U6.4(PP/GPIO/TWI_WAKEUP#) U7.6(INT2) U7.7(INT1) U8.40(CLK_REQ) XU2.39(TE)

## Notes on the sheet
- System in Package - C and D
- 5
- System in Package - E and F | microSD, IMU and TPM | RFID and Antenna Matching
- Low Power State Control | LCD, Touchscreen and UART to USB | System in Package - A | System in Package - B
- 6 | 7 | 8
- 1 | 2 | 3 | 4

## Library data of the parts
C1-C31 = resistor:C-US: CAPACITOR, American symbol
D1-D5 = SparkFun-LED:LED: LED (Generic) Standard schematic elements and footprints for 5mm, 3mm, 1206, and 0603 sized LEDs. Generic LEDs with no color specified.
J1 = Megahash:SH-CONNECTOR
J2 = Megahash:MICRO_USB_AB_SMD
J3 = Megahash:UARTPINS
L1 L2 = TPM:INDUCTOR: Inductors Basic Inductor/Choke - 0603 and 1206. Footprints are not proven and vary greatly between part numbers. INDUCTOR POWER 3.3UH 4.0A SMD 0.197" L x 0.197" W x 0.177" H (5.00mm x 5.00mm x 4.50mm)
Q1 = Megahash:MMBT2222A
R1-R21 = resistor:R-US_: RESISTOR, American symbol
RN1 = resistor-dil:2R-N: Array Chip Resistor Source: Panasonic; OC_FARNELL: unknown; OC_NEWARK: unknown
RN2 = resistor-dil:4R-N: Array Chip Resistor Source: RS Component / Phycomp; OC_FARNELL: unknown; OC_NEWARK: unknown
S1 = Megahash:PUSHBUTTON
TP1-TP16 = testpad:PTR1: TEST PIN
TP17 TP18 = testpad:TPS: TEST PIN
U1 = Megahash:STM660
U2 = Megahash:TPS22916B
U3 = ftdichip:FT232R: Source: http://www.ftdichip.com/Documents/DataSheets/DS_FT232R_v104.pdf; MPN: FT232RQ-REEL; OC_FARNELL: 1146033; OC_NEWARK: 91K9919
U4 = Octavo-Systems:OSD3358-512M-BSM: Octavo Systems LLC OSD335x Family SiP: 21mm x 21mm, 1.27mm pitch 256 pin BGA contains AM3358, 512MB DDR3, TPS65217, TL5209, EEPROM and passives. Commerical Temperature: 0C to 85C.; MPN: BB-POCKET; OC_NEWARK: 45AC6372
U5 = Texas Instruments_By_element14_Batch_1:SN74LVC1G07DSFR: SINGLE BUFFER/DRIVER; MPN: SN74LVC1G07DSFR; OC_FARNELL: 2057110; OC_NEWARK: 64T4114; PACKAGE: SON-6; SUPPLIER: TEXAS INSTRUMENTS
U6 = Megahash:AT97SC3205: AT97SC3205 Atmel Trusted Platform Module – I2C Interface The Atmel AT97SC3205 is a fully integrated security module designed to be integrated into personal computers and other embedded systems. It implements version 1.2 of the Trusted Computing Group (TCG) specification for Trusted Platform Modules (TPM). Package: 32 pin QFN Online info: Datasheet <http://ww1.microchip.com/downloads/en/DeviceDoc/Atmel-8883S-TPM-AT97SC3205T-Datasheet-Summary.pdf> and Digikey page <https://www.digikey.com/product-detail/en/microchip-technology/AT97SC3205T-G3M4C-10/AT97SC3205T-G3M4C-10CT-ND/7796837>.
U7 = Megahash:LSM6DS33; MPN: LSM6DS33TR; OC_NEWARK: 18AC7419
U8 = Megahash:PN7150
XU1 = Megahash:CAPTOUCHSCREEN_6PINFPC
XU2 = Megahash:ILI9388_50PIN_SOCKET
XU3 = Megahash:MICROSD_CARDHOLDER
Y1 = Megahash:TSX-3225
Y2 = Megahash:CRISTAL_XRCGB

## Board
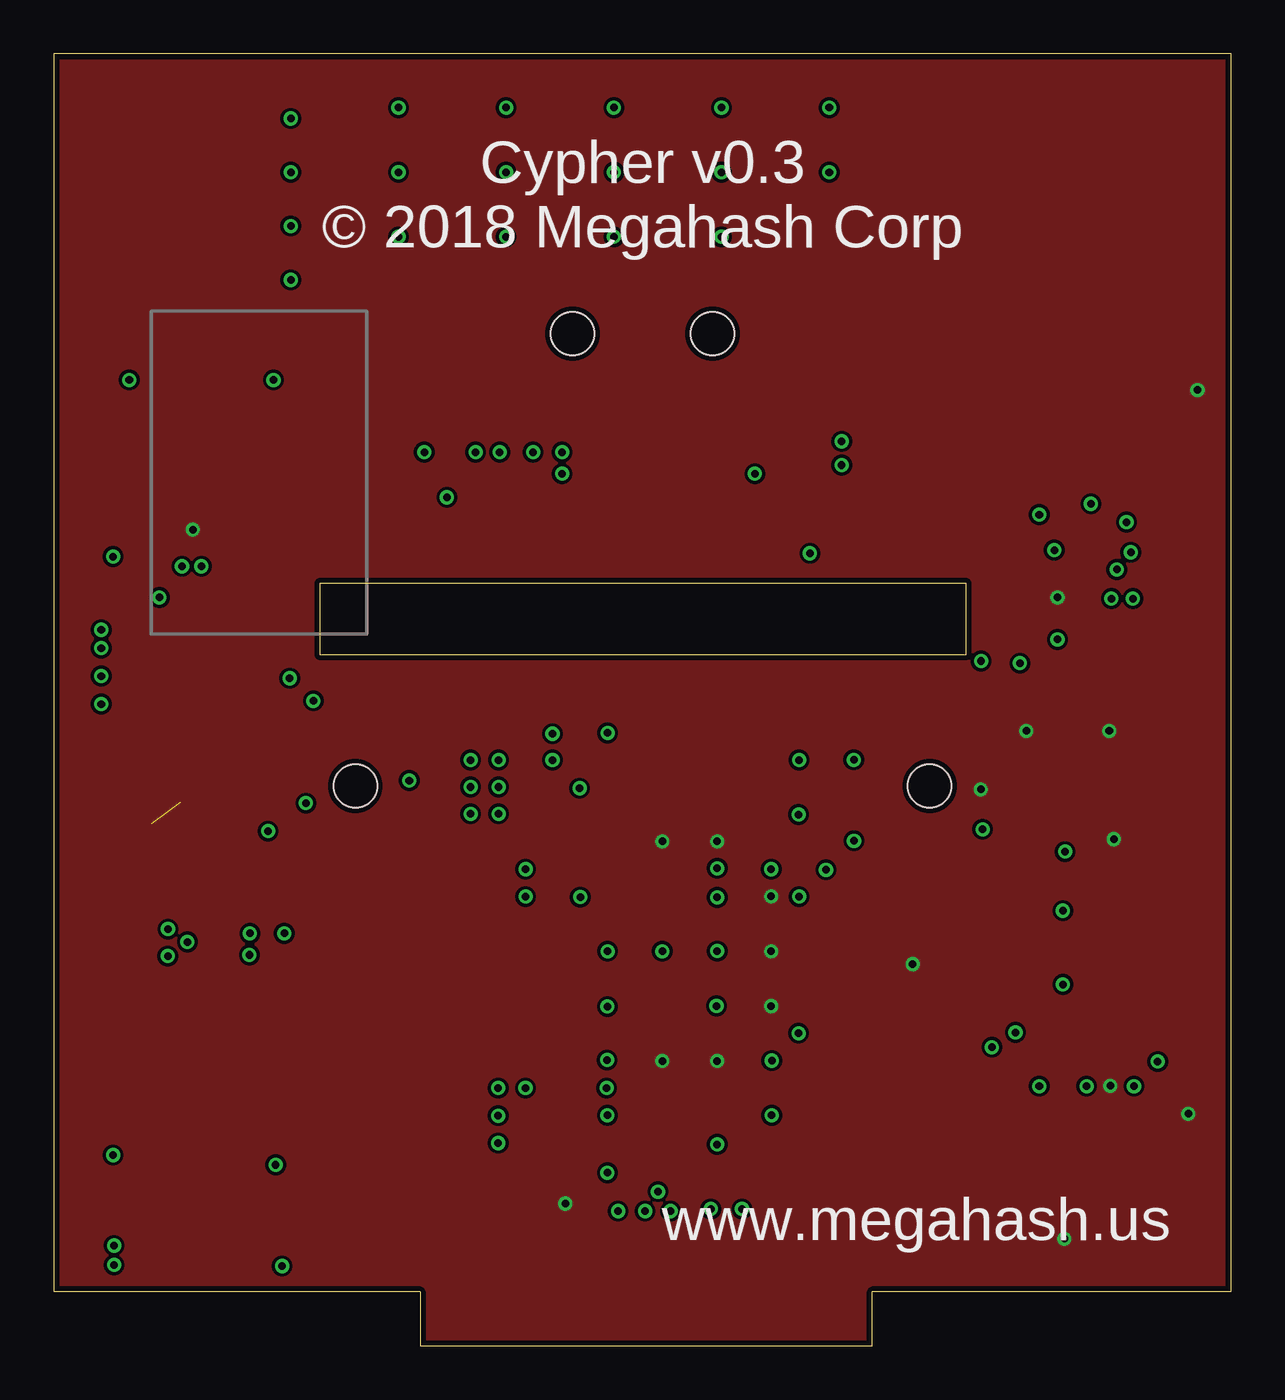
[diagram p6: board, top side]
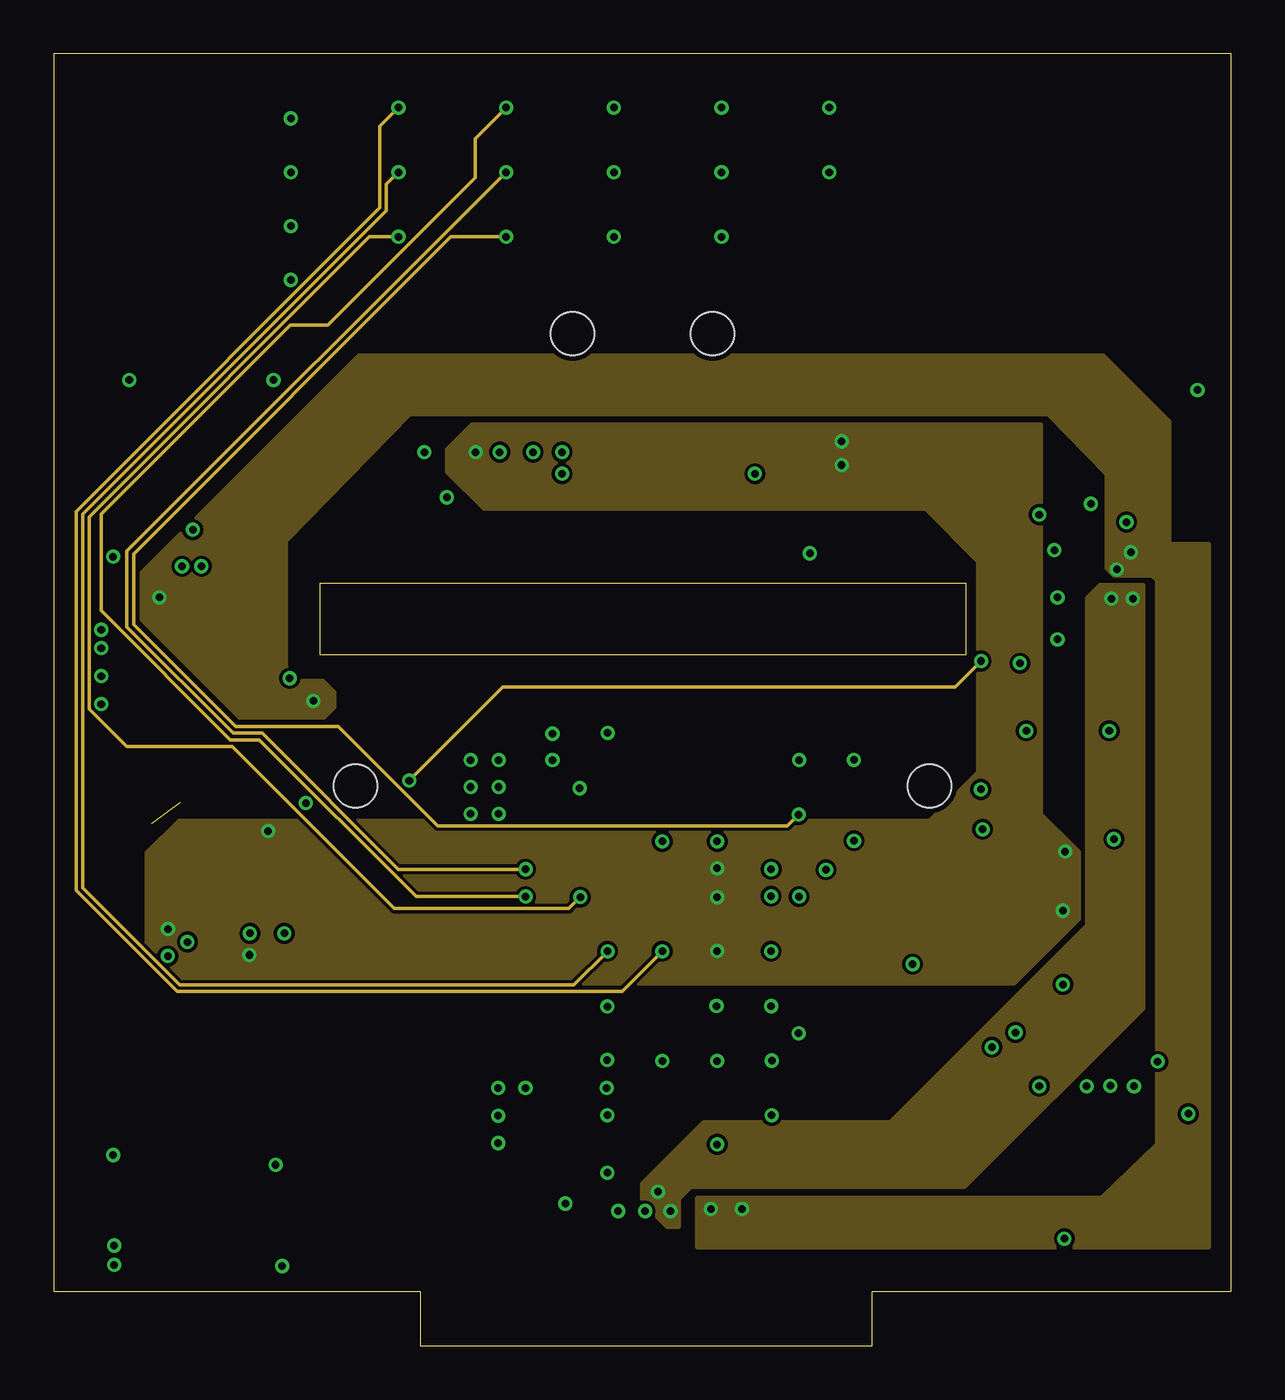
[diagram p7: board, inner layer VCC]
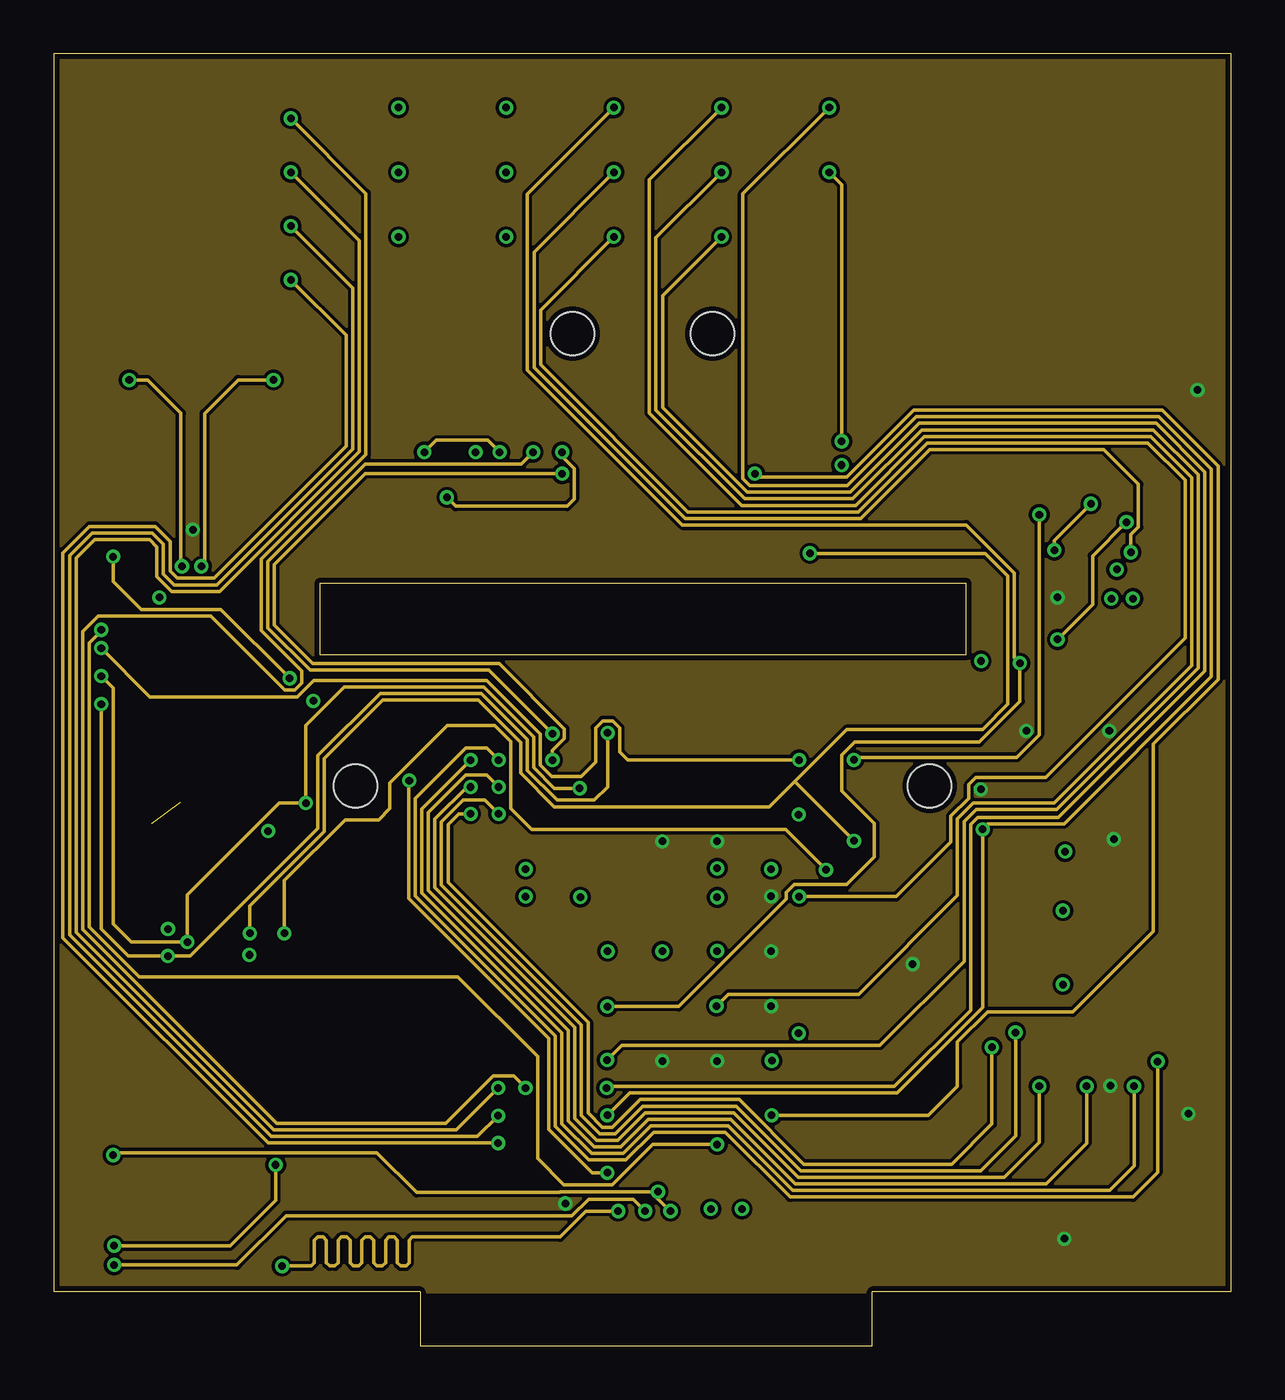
[diagram p8: board, inner layer Signal]
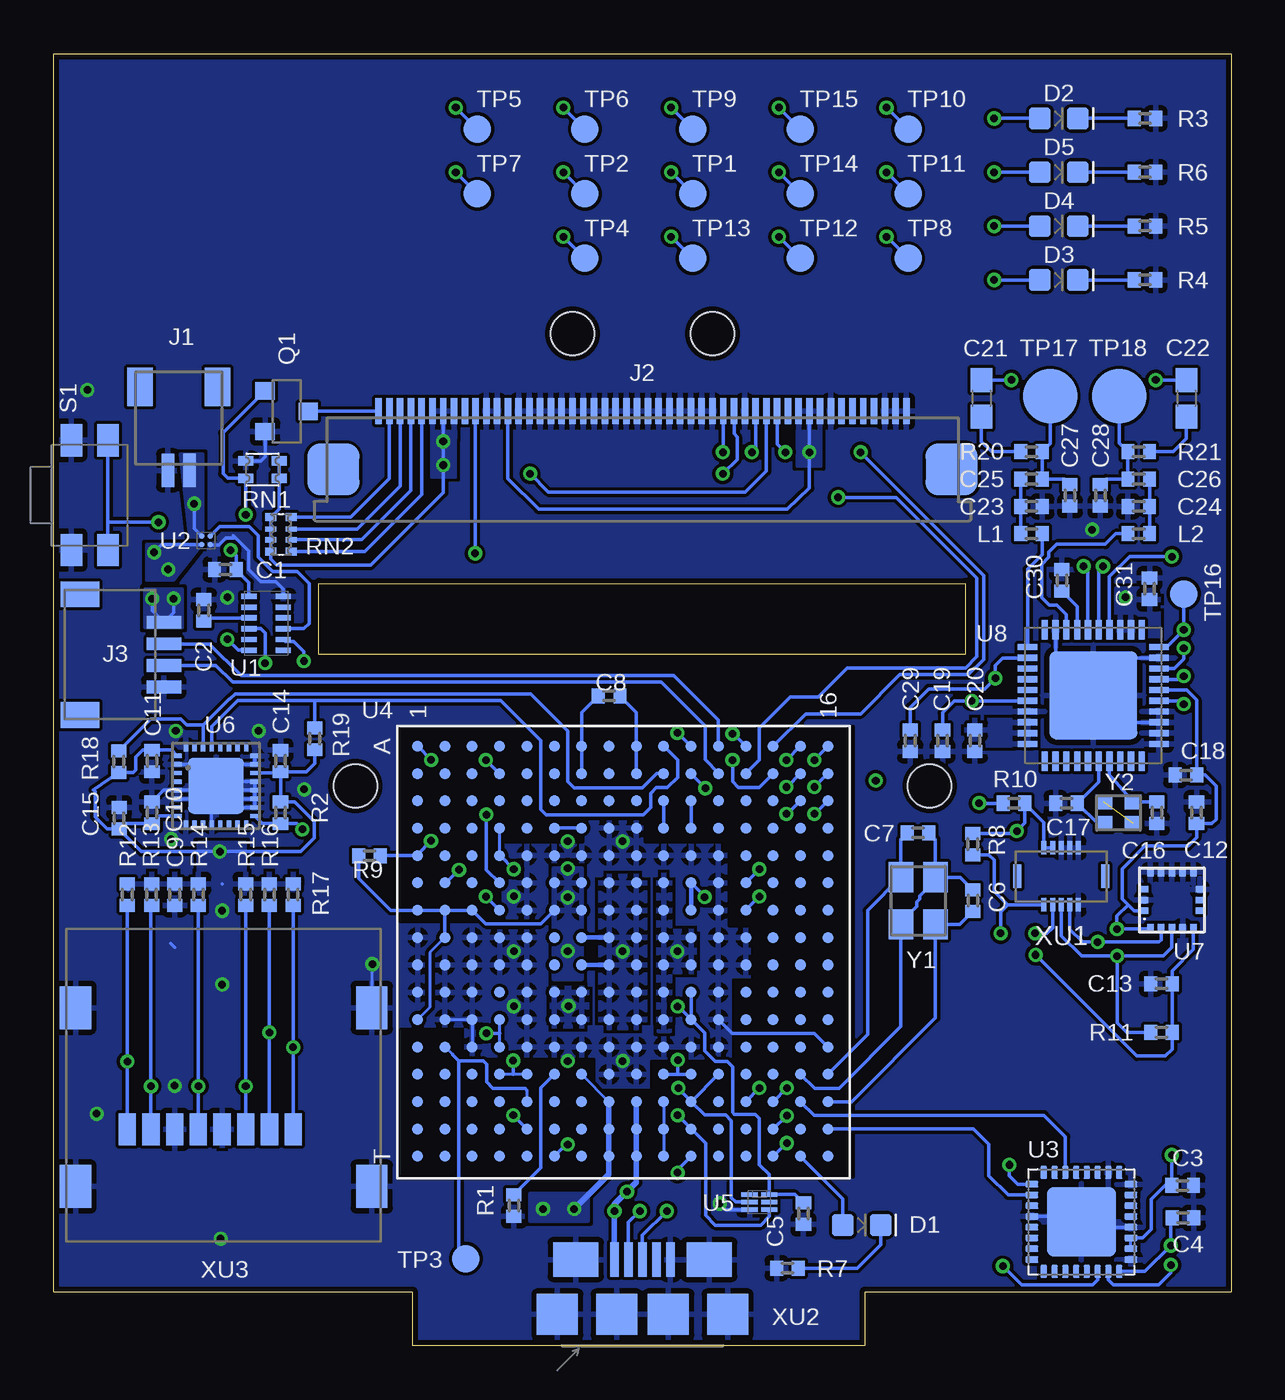
[diagram p9: board, bottom side, seen from below]

Size 54.66 x 60 mm. Coordinates in mm from the lower left corner, seen from the top.
Outline: 54.66,2.5 54.66,60 0,60 0,2.5 17,2.5 17,0 38,0 38,2.5 54.66,2.5
Outline: 12.35,35.4 12.35,32.1 42.35,32.1 42.35,35.4 12.35,35.4
Copper layers (1*2*15*16): Top 0.035mm / dielectric 0.23mm / VCC 0.035mm / dielectric 0.2mm / Signal 0.035mm / dielectric 0.23mm / Bottom 0.035mm
Design rules "MF_4_mil_drill_4_Layer *": minimum track width 5mil, minimum drill 4mil, track to track 6mil, track to pad 0.21mm, pad to pad 5mil, via to via 6mil, smd to smd 0mil, copper to edge 10mil, drill to drill 10mil, minimum pad ring 6mil, minimum via ring 6mil, stop-mask expansion 2mil, vias tented up to drill 2mm, thermal gap 10mil
Holes 2 mm at 24.08,47 30.58,47 14,26 40.66,26

### Footprints (pad centres in the part's own frame; a part is rotated, then mirrored left to right if it is on the bottom)
C0402 = smd 0.6 x 0.7: 1 -0.5,0; 2 0.5,0
C0603 = smd 1.1 x 1: 1 -0.85,0; 2 0.85,0
LED-0603 = smd 1 x 1: A -0.877,0; C 0.877,0
SH_CONNECTOR = smd 0.6 x 1.55: 1 0.5,4.775; 2 -0.5,4.775 | smd 1.2 x 1.8: PAD1 1.8,0.9; PAD2 -1.8,0.9
MICRO-USB-AB-SMD = smd 0.4 x 1.6: 1 -1.3,4; 2 -0.65,4; 3 0,4; 4 0.65,4; 5 1.3,4 | smd 2.1 x 1.6: PAD1 -3.1,4; PAD2 3.1,4 | smd 1.9 x 1.9: PAD3 -3.95,1.45; PAD4 -1.2,1.45; PAD5 1.2,1.45; PAD6 3.95,1.45
SM04B-SRSS-TB = smd 0.6 x 1.6: 1 -1.5,3.9; 2 -0.5,3.9; 3 0.5,3.9; 4 1.5,3.9 | smd 1.2 x 1.8: PADA -2.8,0; PADB 2.8,0
SOT-23-3 = smd 0.8 x 0.9: B -0.95,-1; C 0,1; E 0.95,-1
R0402 = smd 0.6 x 0.7: 1 -0.5,0; 2 0.5,0
EXBV4V = smd 0.45 x 0.7: 1 -0.4,-0.775; 2 0.4,-0.775; 3 0.4,0.775; 4 -0.4,0.775
EXBN8V = smd 0.38 x 0.5: 1 -0.8,-0.475; 4 0.8,-0.475; 5 0.8,0.475; 8 -0.8,0.475 | smd 0.25 x 0.5: 2 -0.25,-0.475; 3 0.25,-0.475; 6 0.25,0.475; 7 -0.25,0.475
EVQ-PUK = smd 1.5 x 1: 1 2.55,0.85; 2 2.55,-0.85; 3 -2.55,0.85; 4 -2.55,-0.85
B1,27 = smd 1.27 x 1.27: TP 0,0
B2,54 = smd 2.54 x 2.54: TP 0,0
TDFN12 = smd 0.25 x 0.7: 1 -1.25,-0.8; 2 -0.75,-0.8; 3 -0.25,-0.8; 4 0.25,-0.8; 5 0.75,-0.8; 6 1.25,-0.8; 7 1.25,0.8; 8 0.75,0.8; 9 0.25,0.8; 10 -0.25,0.8; 11 -0.75,0.8; 12 -1.25,0.8
WSON-4PIN = smd 0.25 x 0.25: A1 0.2,-0.2; A2 -0.2,-0.2; B1 0.2,0.2; B2 -0.2,0.2
QFN32 = smd 0.6 x 0.3: 1 -2.3,1.75; 2 -2.3,1.25; 3 -2.3,0.75; 4 -2.3,0.25; 5 -2.3,-0.25; 6 -2.3,-0.75; 7 -2.3,-1.25; 8 -2.3,-1.75; 17 2.3,-1.75; 18 2.3,-1.25; 19 2.3,-0.75; 20 2.3,-0.25; 21 2.3,0.25; 22 2.3,0.75; 23 2.3,1.25; 24 2.3,1.75 | smd 0.3 x 0.6: 9 -1.75,-2.3; 10 -1.25,-2.3; 11 -0.75,-2.3; 12 -0.25,-2.3; 13 0.25,-2.3; 14 0.75,-2.3; 15 1.25,-2.3; 16 1.75,-2.3; 25 1.75,2.3; 26 1.25,2.3; 27 0.75,2.3; 28 0.25,2.3; 29 -0.25,2.3; 30 -0.75,2.3; 31 -1.25,2.3; 32 -1.75,2.3 | smd 3.2 x 3.2: EXP 0,0
OSD335X-BGA-256 = smd 0.5 x 0.5: A1 -9.525,-9.525; A2 -9.525,-8.255; A3 -9.525,-6.985; A4 -9.525,-5.715; A5 -9.525,-4.445; A6 -9.525,-3.175; A7 -9.525,-1.905; A8 -9.525,-0.635; A9 -9.525,0.635; A10 -9.525,1.905; A11 -9.525,3.175; A12 -9.525,4.445; A13 -9.525,5.715; A14 -9.525,6.985; A15 -9.525,8.255; A16 -9.525,9.525; B1 -8.255,-9.525; B2 -8.255,-8.255; B3 -8.255,-6.985; B4 -8.255,-5.715; B5 -8.255,-4.445; B6 -8.255,-3.175; B7 -8.255,-1.905; B8 -8.255,-0.635; B9 -8.255,0.635; B10 -8.255,1.905; B11 -8.255,3.175; B12 -8.255,4.445; B13 -8.255,5.715; B14 -8.255,6.985; B15 -8.255,8.255; B16 -8.255,9.525; C1 -6.985,-9.525; C2 -6.985,-8.255; C3 -6.985,-6.985; C4 -6.985,-5.715; C5 -6.985,-4.445; C6 -6.985,-3.175; C7 -6.985,-1.905; C8 -6.985,-0.635; C9 -6.985,0.635; C10 -6.985,1.905; C11 -6.985,3.175; C12 -6.985,4.445; C13 -6.985,5.715; C14 -6.985,6.985; C15 -6.985,8.255; C16 -6.985,9.525; D1 -5.715,-9.525; D2 -5.715,-8.255; D3 -5.715,-6.985; D4 -5.715,-5.715; D5 -5.715,-4.445; D6 -5.715,-3.175; D7 -5.715,-1.905; D8 -5.715,-0.635; D9 -5.715,0.635; D10 -5.715,1.905; D11 -5.715,3.175; D12 -5.715,4.445; D13 -5.715,5.715; D14 -5.715,6.985; D15 -5.715,8.255; D16 -5.715,9.525; E1 -4.445,-9.525; E2 -4.445,-8.255; E3 -4.445,-6.985; E4 -4.445,-5.715; E5 -4.445,-4.445; E6 -4.445,-3.175; E7 -4.445,-1.905; E8 -4.445,-0.635; E9 -4.445,0.635; E10 -4.445,1.905; E11 -4.445,3.175; E12 -4.445,4.445; E13 -4.445,5.715; E14 -4.445,6.985; E15 -4.445,8.255; E16 -4.445,9.525; F1 -3.175,-9.525; F2 -3.175,-8.255; F3 -3.175,-6.985; F4 -3.175,-5.715; F5 -3.175,-4.445; F6 -3.175,-3.175; F7 -3.175,-1.905; F8 -3.175,-0.635; F9 -3.175,0.635; F10 -3.175,1.905; F11 -3.175,3.175; F12 -3.175,4.445; F13 -3.175,5.715; F14 -3.175,6.985; F15 -3.175,8.255; F16 -3.175,9.525; G1 -1.905,-9.525; G2 -1.905,-8.255; G3 -1.905,-6.985; G4 -1.905,-5.715; G5 -1.905,-4.445; G6 -1.905,-3.175; G7 -1.905,-1.905; G8 -1.905,-0.635; G9 -1.905,0.635; G10 -1.905,1.905; G11 -1.905,3.175; G12 -1.905,4.445; G13 -1.905,5.715; G14 -1.905,6.985; G15 -1.905,8.255; G16 -1.905,9.525; H1 -0.635,-9.525; H2 -0.635,-8.255; H3 -0.635,-6.985; H4 -0.635,-5.715; H5 -0.635,-4.445; H6 -0.635,-3.175; H7 -0.635,-1.905; H8 -0.635,-0.635; H9 -0.635,0.635; H10 -0.635,1.905; H11 -0.635,3.175; H12 -0.635,4.445; H13 -0.635,5.715; H14 -0.635,6.985; H15 -0.635,8.255; H16 -0.635,9.525; J1 0.635,-9.525; J2 0.635,-8.255; J3 0.635,-6.985; J4 0.635,-5.715; J5 0.635,-4.445; J6 0.635,-3.175; J7 0.635,-1.905; J8 0.635,-0.635; J9 0.635,0.635; J10 0.635,1.905; J11 0.635,3.175; J12 0.635,4.445; J13 0.635,5.715; J14 0.635,6.985; J15 0.635,8.255; J16 0.635,9.525; K1 1.905,-9.525; K2 1.905,-8.255; K3 1.905,-6.985; K4 1.905,-5.715; K5 1.905,-4.445; K6 1.905,-3.175; K7 1.905,-1.905; K8 1.905,-0.635; K9 1.905,0.635; K10 1.905,1.905; K11 1.905,3.175; K12 1.905,4.445; K13 1.905,5.715; K14 1.905,6.985; K15 1.905,8.255; K16 1.905,9.525; L1 3.175,-9.525; L2 3.175,-8.255; L3 3.175,-6.985; L4 3.175,-5.715; L5 3.175,-4.445; L6 3.175,-3.175; L7 3.175,-1.905; L8 3.175,-0.635; L9 3.175,0.635; L10 3.175,1.905; L11 3.175,3.175; L12 3.175,4.445; L13 3.175,5.715; L14 3.175,6.985; L15 3.175,8.255; L16 3.175,9.525; M1 4.445,-9.525; M2 4.445,-8.255; M3 4.445,-6.985; M4 4.445,-5.715; M5 4.445,-4.445; M6 4.445,-3.175; M7 4.445,-1.905; M8 4.445,-0.635; M9 4.445,0.635; M10 4.445,1.905; M11 4.445,3.175; M12 4.445,4.445; M13 4.445,5.715; M14 4.445,6.985; M15 4.445,8.255; M16 4.445,9.525; N1 5.715,-9.525; N2 5.715,-8.255; N3 5.715,-6.985; N4 5.715,-5.715; N5 5.715,-4.445; N6 5.715,-3.175; N7 5.715,-1.905; N8 5.715,-0.635; N9 5.715,0.635; N10 5.715,1.905; N11 5.715,3.175; N12 5.715,4.445; N13 5.715,5.715; N14 5.715,6.985; N15 5.715,8.255; N16 5.715,9.525; P1 6.985,-9.525; P2 6.985,-8.255; P3 6.985,-6.985; P4 6.985,-5.715; P5 6.985,-4.445; P6 6.985,-3.175; P7 6.985,-1.905; P8 6.985,-0.635; P9 6.985,0.635; P10 6.985,1.905; P11 6.985,3.175; P12 6.985,4.445; P13 6.985,5.715; P14 6.985,6.985; P15 6.985,8.255; P16 6.985,9.525; R1 8.255,-9.525; R2 8.255,-8.255; R3 8.255,-6.985; R4 8.255,-5.715; R5 8.255,-4.445; R6 8.255,-3.175; R7 8.255,-1.905; R8 8.255,-0.635; R9 8.255,0.635; R10 8.255,1.905; R11 8.255,3.175; R12 8.255,4.445; R13 8.255,5.715; R14 8.255,6.985; R15 8.255,8.255; R16 8.255,9.525; T1 9.525,-9.525; T2 9.525,-8.255; T3 9.525,-6.985; T4 9.525,-5.715; T5 9.525,-4.445; T6 9.525,-3.175; T7 9.525,-1.905; T8 9.525,-0.635; T9 9.525,0.635; T10 9.525,1.905; T11 9.525,3.175; T12 9.525,4.445; T13 9.525,5.715; T14 9.525,6.985; T15 9.525,8.255; T16 9.525,9.525
SON35P100X100X40-6N = smd 0.762 x 0.203: 1 -0.457,0.356; 2 -0.457,0; 3 -0.457,-0.356; 4 0.457,-0.356; 5 0.457,0; 6 0.457,0.356
QFN32-4MM = smd 0.4 x 0.2: 1 -1.8,1.4; 2 -1.8,1; 3 -1.8,0.6; 4 -1.8,0.2; 5 -1.8,-0.2; 6 -1.8,-0.6; 7 -1.8,-1; 8 -1.8,-1.4; 17 1.8,-1.4; 18 1.8,-1; 19 1.8,-0.6; 20 1.8,-0.2; 21 1.8,0.2; 22 1.8,0.6; 23 1.8,1; 24 1.8,1.4 | smd 0.2 x 0.4: 9 -1.4,-1.8; 10 -1,-1.8; 11 -0.6,-1.8; 12 -0.2,-1.8; 13 0.2,-1.8; 14 0.6,-1.8; 15 1,-1.8; 16 1.4,-1.8; 25 1.4,1.8; 26 1,1.8; 27 0.6,1.8; 28 0.2,1.8; 29 -0.2,1.8; 30 -0.6,1.8; 31 -1,1.8; 32 -1.4,1.8 | smd 2.6 x 2.6: EXP 0,0
LGA-16 = smd 0.3 x 0.4: 1 1,1.3; 2 0.5,1.3; 3 0,1.3; 4 -0.5,1.3; 5 -1,1.3; 9 -1,-1.3; 10 -0.5,-1.3; 11 0,-1.3; 12 0.5,-1.3; 13 1,-1.3 | smd 0.4 x 0.3: 6 -1.3,0.5; 7 -1.3,0; 8 -1.3,-0.5; 14 1.3,-0.5; 15 1.3,0; 16 1.3,0.5
HVQFN40 = smd 0.9 x 0.29: 1 -3.05,2.25; 2 -3.05,1.75; 3 -3.05,1.25; 4 -3.05,0.75; 5 -3.05,0.25; 6 -3.05,-0.25; 7 -3.05,-0.75; 8 -3.05,-1.25; 9 -3.05,-1.75; 10 -3.05,-2.25; 21 3.05,-2.25; 22 3.05,-1.75; 23 3.05,-1.25; 24 3.05,-0.75; 25 3.05,-0.25; 26 3.05,0.25; 27 3.05,0.75; 28 3.05,1.25; 29 3.05,1.75; 30 3.05,2.25 | smd 0.29 x 0.9: 11 -2.25,-3.05; 12 -1.75,-3.05; 13 -1.25,-3.05; 14 -0.75,-3.05; 15 -0.25,-3.05; 16 0.25,-3.05; 17 0.75,-3.05; 18 1.25,-3.05; 19 1.75,-3.05; 20 2.25,-3.05; 31 2.25,3.05; 32 1.75,3.05; 33 1.25,3.05; 34 0.75,3.05; 35 0.25,3.05; 36 -0.25,3.05; 37 -0.75,3.05; 38 -1.25,3.05; 39 -1.75,3.05; 40 -2.25,3.05 | smd 4.1 x 4.1: EXP 0,0
DF37NB-10DS-0.4V = smd 0.23 x 0.63: 1 -0.8,-1.325; 2 -0.4,-1.325; 3 0,-1.325; 4 0.4,-1.325; 5 0.8,-1.325; 6 0.8,1.325; 7 0.4,1.325; 8 0,1.325; 9 -0.4,1.325; 10 -0.8,1.325 | smd 0.38 x 1.1: PADA 2.04,0; PADB -2.04,0
FPC/FFC_50PIN_0.5MMPITCH = smd 0.3 x 1.2: 1 -12.25,40.9; 2 -11.75,40.9; 3 -11.25,40.9; 4 -10.75,40.9; 5 -10.25,40.9; 6 -9.75,40.9; 7 -9.25,40.9; 8 -8.75,40.9; 9 -8.25,40.9; 10 -7.75,40.9; 11 -7.25,40.9; 12 -6.75,40.9; 13 -6.25,40.9; 14 -5.75,40.9; 15 -5.25,40.9; 16 -4.75,40.9; 17 -4.25,40.9; 18 -3.75,40.9; 19 -3.25,40.9; 20 -2.75,40.9; 21 -2.25,40.9; 22 -1.75,40.9; 23 -1.25,40.9; 24 -0.75,40.9; 25 -0.25,40.9; 26 0.25,40.9; 27 0.75,40.9; 28 1.25,40.9; 29 1.75,40.9; 30 2.25,40.9; 31 2.75,40.9; 32 3.25,40.9; 33 3.75,40.9; 34 4.25,40.9; 35 4.75,40.9; 36 5.25,40.9; 37 5.75,40.9; 38 6.25,40.9; 39 6.75,40.9; 40 7.25,40.9; 41 7.75,40.9; 42 8.25,40.9; 43 8.75,40.9; 44 9.25,40.9; 45 9.75,40.9; 46 10.25,40.9; 47 10.75,40.9; 48 11.25,40.9; 49 11.75,40.9; 50 12.25,40.9 | smd 2.4 x 2.4: PADA -14.35,38.2; PADB 14.35,38.2
HINGED_LID_MICROSD = smd 0.8 x 1.5: 1 3.225,-1.5; 2 2.125,-1.5; 3 1.025,-1.5; 4 -0.075,-1.5; 5 -1.175,-1.5; 6 -2.275,-1.5; 7 -3.375,-1.5; 8 -4.475,-1.5 | smd 1.45 x 2: G1 6.875,-4.15; G2 6.875,4.15; G3 -6.875,4.15; G4 -6.875,-4.15
4-SMD = smd 1.4 x 1.15: 1 -1.1,-0.8; 2 1.1,-0.8; 3 1.1,0.8; 4 -1.1,0.8
XRCGB = smd 0.75 x 0.7: 1 -0.675,-0.5; 2 0.675,-0.5; 3 0.675,0.5; 4 -0.675,0.5

### Placement (x,y rotation side)
C1  46.7,36.05 180 bottom
C2  47.7,34.15 90 bottom
C3  2.25,7.44 0 bottom
C4  2.23,5.94 0 bottom
C5  19.86,6.13 270 bottom
C6  11.99,20.66 90 bottom
C7  14.53,23.82 0 bottom
C8  28.88,30.18 0 bottom
C9  49.05,20.95 270 bottom
C10  50.1,24.74 90 bottom
C11  50.1,27.16 270 bottom
C12  1.61,24.75 90 bottom
C13  3.23,16.81 180 bottom
C14  44.13,27.16 90 bottom
C15  51.63,24.5 90 bottom
C16  3.45,24.75 270 bottom
C17  7.65,25.19 180 bottom
C18  2.1,26.5 180 bottom
C19  13.4,28.1 270 bottom
C20  11.9,28.1 270 bottom
C21  11.6,44 270 bottom
C22  2.08,44 270 bottom
C23  9.27,38.98 0 bottom
C24  4.29,38.98 180 bottom
C25  9.27,40.25 0 bottom
C26  4.29,40.25 180 bottom
C27  7.49,39.49 270 bottom
C28  6.07,39.49 270 bottom
C29  14.9,28.1 270 bottom
C30  7.86,35.55 90 bottom
C31  3.79,35.15 90 bottom
D1  17.15,5.6 0 bottom
D2  8,57 0 bottom
D3  8,49.5 0 bottom
D4  8,52 0 bottom
D5  8,54.5 0 bottom
J1  48.86,45.43 180 bottom
J2  27.33,0 0 bottom
J3  53.45,32.1 270 bottom
L1  9.27,37.71 180 bottom
L2  4.29,37.71 0 bottom
Q1  43.85,43.4 270 bottom
R1  33.3,6.5 90 bottom
R2  44.13,24.74 90 bottom
R3  4,57 180 bottom
R4  4,49.5 180 bottom
R5  4,52 180 bottom
R6  4,54.5 180 bottom
R7  20.6,3.6 0 bottom
R8  12,23.3 90 bottom
R9  40,22.75 180 bottom
R10  10.08,25.19 0 bottom
R11  3.23,14.55 0 bottom
R12  51.25,20.95 90 bottom
R13  50.12,20.95 90 bottom
R14  47.95,20.95 90 bottom
R15  45.75,20.95 90 bottom
R16  44.65,20.95 90 bottom
R17  43.55,20.95 90 bottom
R18  51.65,27.13 90 bottom
R19  42.55,28.18 90 bottom
R20  9.27,41.52 0 bottom
R21  4.29,41.52 180 bottom
RN1  44.97,40.69 90 bottom
RN2  44.11,37.68 270 bottom
S1  53,39.5 270 bottom
TP1  25,53.5 0 bottom
TP2  30,53.5 0 bottom
TP3  35.53,4.04 0 bottom
TP4  30,50.5 0 bottom
TP5  35,56.5 0 bottom
TP6  30,56.5 0 bottom
TP7  35,53.5 0 bottom
TP8  15,50.5 0 bottom
TP9  25,56.5 0 bottom
TP10  15,56.5 0 bottom
TP11  15,53.5 0 bottom
TP12  20,50.5 0 bottom
TP13  25,50.5 0 bottom
TP14  20,53.5 0 bottom
TP15  20,56.5 0 bottom
TP16  2.2,34.92 90 bottom
TP17  8.4,44.1 270 bottom
TP18  5.2,44.1 270 bottom
U1  44.8,33.55 270 bottom
U2  47.6,37.4 270 bottom
U3  6.95,5.75 0 bottom
U4  28.25,18.32 270 bottom
U5  21.9,6.67 0 bottom
U6  47.13,26 0 bottom
U7  2.75,20.69 180 bottom
U8  6.4,30.2 180 bottom
XU1  7.89,21.8 0 bottom
XU2  27.33,2.5 0 bottom
XU3  46.77,11.54 0 bottom
Y1  14.53,20.66 90 bottom
Y2  5.23,24.75 0 bottom

### Tracks (layer width: path | path; a pad name or v marks a point on that pad's centre or on a via)
3V3  (via drill 0.35)
  Signal 0.152: v36,54.5 36.58,53.92 v36.58,42
  Bottom 0.15: U4.H2 37.2,18.26 37.2,15.72 U4.L1
  Bottom 0.152: C14.1 44.1,26.6 44.13,26.57 R2.2 43.47,25.24 42.56,24.34 42.56,23.59 43.2,22.95 v46.95,22.95 50.6,22.95 51.63,23.98 C15.1 | TP7.TP v36,54.5 | U6.1 49.19,27.66 C11.1 50.54,27.66 50.85,27.35 50.85,26.75 50.97,26.63 R18.1 52.82,25.82 52.75,25.75 52.75,24.56 52.19,24 C15.1 | U6.22 44.19,26.6 C14.1 | 36.51,20.12 U4.G2 U4.G1 39.02,20.23 40.5,21.7 R9.2 | 36.51,20.12 U4.H2 | 36.51,20.12 36.4,20.23 U4.G3 34.6,19.59 32.05,19.59 U4.G6 | C15.1 51.38,24.24 C10.1 49.75,24.6 U6.8 | 46.85,21.45 | XU2.13 33.58,40.28 32.15,38.85 20.6,38.85 19.58,39.82 v19.58,41.5 XU2.41 | RN1.2 RN1.1 44.2,38.87 RN2.1 RN2.2 RN2.3 RN2.4 44.59,36.53 44.3,36.25 39.95,36.25 36.58,39.62 v36.58,42 XU2.7 | XU1.9 XU1.10 8.69,24.3 R10.2 9.58,24.27 v9.95,23.9 10.05,23.8 R8.2 | R19.1 42.55,27.05 42.94,26.66 C14.1 | U8.6 2.05,30.45 1.6,30 C18.1 1.2,26.5 0.7,26 0.7,24.45 0.9,24.25 C12.1 1.61,23.59 2,23.2 4,23.2 5.05,22.15 5.05,20.75 4.78,20.48 | 4.78,20.48 4.49,20.19 U7.16 | U7.1 3.79,19.35 v5.3,19.35 5.3,19.95 4.78,20.48 | U7.5 1.75,18.4 2.74,17.41 C13.1 R11.2 2.73,13.77 3.05,13.45 4.38,13.45 v9.08,18.15
  other vias: 30.8,20.82 30.8,22.17 46.85,16.78 30.8,18.33 46.85,20.2 36.58,40.9
  pour Bottom: 31.45,17.03 31.45,22.17 30.15,22.17 30.15,17.03
  pour Bottom: 51.22,21.11 50.67,21.96 42.97,21.96 43.52,21.11
  pour Bottom: 45.73,9.27 47.89,9.27 47.94,23.37 45.78,23.37
  pour Bottom: 20.15,43.55 20.15,40.85 19.05,40.85 19.05,43.55
  pour Bottom: 37.11,43.9 37.11,40.35 36.03,40.35 36.01,43.9
  pour VCC (rank 3): 45.85,42.8 19.4,42.8 18.25,41.65 18.25,40.55 19.95,38.85 40.45,38.85 42.9,36.4 42.9,26.65 40.65,24.4 5.8,24.4 4.3,22.9 4.3,17.9 5.4,16.8 41.25,16.8 47.5,23.05 45.85,24.7
  pour VCC (rank 3): 40.45,16.8 44.6,16.8 47.6,19.8 47.6,22.95 46.65,23.9 40.45,17.7
#RESET  (via drill 0.35)
  Signal 0.152: v25.7,10.7 26.73,11.73 39.15,11.73 43.12,15.7 v43.12,23.98 43.37,24.23 46.9,24.23 53.74,31.08 53.74,40.7 51.3,43.15 40.04,43.15 36.84,39.94 32.32,39.94 31.99,40.27 31.99,53.49 v36,57.5
  Bottom 0.152: v25.7,10.7 v25.7,10.69 U4.R11 24.4,9.39 24.4,6.05 23.95,5.6 21.85,5.6 21.44,6.01 U5.4 | U6.17 44.97,24.24 R2.1 43.38,24.24 v43.12,23.98 | v36,57.5 TP5.TP
AIN.VREF+
  Bottom 0.152: C8.1 30.16,29.4 U4.A7 U4.B7
AIN.VREF-
  Bottom 0.152: C8.2 27.61,29.42 U4.A9 U4.B9
ANT_1
  Bottom 0.152: TP17.TP 8.4,41.89 R20.2 C25.2 7.75,40.25 C27.1
ANT_2
  Bottom 0.152: C28.1 5.81,40.25 C26.2 R21.2 5.2,41.93 TP18.TP
BAT_EN
  Bottom 0.152: U1.9 43.05,33.3 42.8,33.55 42.8,35.4 43.35,35.95 44.49,35.95 45.17,36.62 45.17,37.62 45.59,38.04 46.96,38.04 U2.B2
BAT_V+  (via drill 0.35)
  Signal 0.152: v46.45,36.95 46.45,37.4 v48.15,39.1
  Bottom 0.152: U1.1 45.6,35.45 C1.1 46.2,36.7 v46.45,36.95 | U2.A2 48.15,37.95 v48.15,39.1
  pour Bottom (no thermals): 48.35,37.55 47.75,37.55 47.75,41.4 48.8,41.4
CHRG
  Bottom 0.152: U4.T15 18.03,6.83 D1.A
D2_CAT
  Bottom 0.152: R3.2 D2.C
D2_CAT1
  Bottom 0.152: D1.C 16.27,4.68 17.35,3.6 R7.2
D3_CAT
  Bottom 0.152: R4.2 D3.C
D4_CAT
  Bottom 0.152: R5.2 D4.C
D5_CAT
  Bottom 0.152: R6.2 D5.C
EEPROM.WP
  Bottom 0.15: 32.7,11.87 U4.P5 | U4.M2 36.15,13.52
  Bottom 0.152: 35.85,13.22 35.86,13.22 36.15,13.51 36.15,13.52 | 35.85,13.22 34.72,13.22 34.57,13.07 34.57,12.25 34.27,11.96 32.78,11.96 32.7,11.87 | 35.85,13.22 35.87,13.2 35.87,4.38 TP3.TP
EMCF_ANTM1
  Bottom 0.152: C25.1 C23.1 L1.2
EMCF_ANTM2
  Bottom 0.152: C26.1 C24.1 L2.2
GND  (via drill 0.35)
  Bottom 0.15: 22.41,6.32 U5.3 | XU3.G2 v39.87,17.72 | U6.12 47.33,25.8 U6.EXP | U4.L2 U4.L3 U4.M3
  Bottom 0.152: 7.4,38.85 C27.2 | 6.1,38.85 C28.2 | U8.9 4.65,31.95 U8.EXP | U6.EXP 46.13,27 U6.23 U6.24 | U6.EXP 46.93,26.2 U6.21 U6.20 | U8.3 5.15,28.95 U8.EXP | U6.19 U6.18 46.13,25 46.53,25.4 | U6.19 U6.20 | 47.06,25.93 U6.EXP | U6.19 46.53,25.4 | 46.53,25.4 46.93,25.8 | U6.20 46.93,25.8 | 46.93,25.8 47.06,25.93 | U6.2 48.13,27 U6.EXP | 47.56,25.8 U6.5 49.55,25.8 C10.2 | 47.56,25.8 47.19,25.8 47.06,25.93 | U6.6 47.96,25.4 47.56,25.8 | 49.05,18.5 49.23,18.68 | U4.M16 19.35,14.5 23.16,14.5 U4.L12 | U3.20 6.7,5.5 U3.EXP 7.2,6 U3.4 | Q1.E 44.85,41.3 45.06,41.09 RN1.3 | U8.19 8.15,31.95 U8.EXP | U5.3 23.46,6.31 v23.75,6.6 | U1.12 44,35.15 44.35,35.5 45.06,35.5 45.61,36.05 45.61,36.9 46.33,37.62 46.33,37.52 46.34,37.51 46.68,37.51 47,37.19 47.1,37.19 U2.B1
  other vias: 28.25,23.42 30.8,23.42 30.8,13.22 28.25,13.22 33.3,15.77 33.3,18.32 33.3,20.87 49.05,12.07 52.67,10.77 46.92,4.97 43.04,25.83 49,28.55 45.15,28.55 49.21,23.52 53.1,44.39 6.45,37.9 46.6,34.75
  pour Bottom (rank 2): 33.3,13.22 28.9,13.22 28.9,12.57 27.55,12.57 27.55,13.77 23.75,13.77 23.75,17.67 22.5,17.67 22.5,18.97 23.75,18.97 23.75,22.77 27.55,22.77 27.55,24.07 28.9,24.07 28.9,23.42 33.3,23.42 33.3,18.97 34,18.97 34,17.62 33.3,17.62
  pour Bottom (rank 6): 0,60 0,0 54.65,-0.15 54.65,60
  pour Top (rank 6): 0,59.65 54.5,59.65 54.5,0 0,0
  pour Signal: 0,60 0,2.5 54.66,2.5 54.66,60
  cutout Bottom: 6.18,25.6 6.18,23.9 4.23,23.9 4.23,25.6
  pour Bottom (no thermals): 47,36.7 47,37.35 47.55,37.35 47.55,36.7
I2C0_SCL
  Bottom 0.152: U4.C10 U4.D10
I2C0_SDA
  Bottom 0.152: U4.D11 U4.C11
I2C1_SCL  (via drill 0.35)
  Signal 0.152: v2.2,31.1 2.76,30.54 2.76,19.59 3.6,18.75 v6.2,18.75 6.2,20.94 10.46,25.2 v11.7,25.2 11.7,28.81 13.48,30.59 19.97,30.59 22.29,28.27 22.29,26.84 23.24,25.89 v24.41,25.89
  Bottom 0.152: U8.7 2.35,30.95 v2.2,31.1 | XU1.4 7.49,19.34 6.9,18.75 v6.2,18.75 3.35,18.75 3.25,18.85 U7.2 | U4.B11 v24.41,25.89 | R10.1 v11.69,25.19 v11.7,25.2
I2C1_SDA  (via drill 0.35)
  Signal 0.152: v25.71,28.46 25.71,25.95 25.09,25.33 23.37,25.33 21.98,26.72 21.98,28.15 19.84,30.29 15.14,30.29 12.26,27.4 12.26,24.02 6.33,18.09 v5.29,18.09 3.46,18.09 2.2,19.35 v2.2,29.8
  Bottom 0.152: U8.5 2.35,29.95 v2.2,29.8 | XU1.3 7.89,19.04 6.94,18.09 v5.29,18.09 | U4.A11 v25.71,28.46 | R11.1 4.85,14.55 5.29,14.99 v5.29,18.09 | U7.3 2.75,18.5 3.16,18.09 v5.29,18.09
LCD_CLK  (via drill 0.35)
  Signal 0.152: v22.25,41.5 21.7,40.95 20.94,40.95 20.93,40.94 14.47,40.94 9.93,36.41 9.93,33.34 11.9,31.37 20.2,31.37 v23.15,28.42
  Bottom 0.152: v22.25,41.5 22.08,41.67 XU2.36 | U4.A13 23.11,28.42 v23.15,28.42
LCD_CS  (via drill 0.35)
  Signal 0.152: v17.2,41.5 17.76,42.06 20.14,42.06 v20.7,41.5
  Bottom 0.152: v20.7,41.5 21.08,41.88 XU2.38 | U4.A14 19.76,29.35 17.2,29.35 15.38,31.17 12.2,31.17 11.49,31.87 11.49,35.78 17.2,41.48 v17.2,41.5
LCD_D/C  (via drill 0.35)
  Signal 0.152: v33.33,10.7 40.6,10.7 41.95,12.05 41.95,14.1 43.35,15.5 47.3,15.5 51.05,19.25 51.05,27.95 54.05,30.95 54.05,40.85 51.45,43.45 39.92,43.45 36.81,40.34 32.71,40.34 v32.55,40.5
  Bottom 0.152: v33.33,10.7 U4.R5 | XU2.37 21.58,40.62 22.55,39.65 31.7,39.65 v32.55,40.5
LCD_MISO  (via drill 0.35)
  Signal 0.152: v23.6,41.5 23.6,41.29 24.16,40.73 24.16,39.32 23.83,38.99 18.66,38.99 v18.25,39.4
  Bottom 0.152: v23.6,41.5 23.58,41.52 XU2.33 | U4.B13 21.9,27.21 21.9,28.7 20.48,30.12 19.18,30.12 17.82,31.48 12.32,31.48 11.8,32 11.8,35.65 15.55,39.4 v18.25,39.4
LCD_MOSI  (via drill 0.35)
  Signal 0.152: v23.15,27.2 23.15,27.64 23.71,28.19 23.71,28.65 20.68,31.68 12.03,31.68 10.24,33.47 10.24,36.28 14.46,40.5 v23.6,40.5
  Bottom 0.152: XU2.34 23.08,42.35 22.94,42.21 22.94,41.16 v23.6,40.5 | U4.B14 21.91,25.93 22.88,25.93 23.15,26.2 v23.15,27.2
LCD_RESET  (via drill 0.35)
  Signal 0.152: 34.39,26.21 36.8,28.62 43.12,28.62 44.29,29.79 44.29,35.75 43.24,36.8 v35.1,36.8 | 34.39,26.21 33.22,25.03 23.24,25.03 21.68,26.59 21.68,28.02 19.71,29.99 15.27,29.99 12.56,27.27 12.56,23.89 9.1,20.43 v9.1,19.15 | v37.15,23.45 34.39,26.21
  Bottom 0.152: XU1.2 8.29,19.41 8.55,19.15 v9.1,19.15 | v37.15,23.45 37.77,22.82 U4.E1 39.48,22.77 R9.1 | v35.1,36.8 35.1,43.38 XU2.10
LEDA@2
  Bottom 0.152: XU2.2 39.08,40.27 40.87,38.48 RN2.8
LEDA@3
  Bottom 0.152: XU2.3 38.58,39.92 40.57,37.93 RN2.7
LEDA@4
  Bottom 0.152: XU2.4 38.08,39.72 40.37,37.43 RN2.6
LEDA@5
  Bottom 0.152: RN2.5 40.22,36.88 37.58,39.52 XU2.5
LEDK
  Bottom 0.152: Q1.C XU2.1
LITE  (via drill 0.35)
  Signal 0.152: v37.14,27.21 v37.15,27.21 37.27,27.33 44.71,27.33 45.75,28.37 v45.75,38.6
  Bottom 0.152: U4.A1 v37.14,27.21 | Q1.B 46.8,42.4 46.8,40.5 46.59,40.29 RN1.4 v45.75,38.6
MMC0.CLK  (via drill 0.35)
  Signal 0.152: v47.95,12.05 47.95,9.4 46.07,7.52 34.43,7.52 31.43,10.52 27.59,10.52 26.31,9.23 25.09,9.23 23.89,10.43 23.89,14.64 17.39,21.14 17.39,24.77 19.12,26.51 20.09,26.51 v20.65,25.95
  Bottom 0.152: U4.B15 20.62,25.95 v20.65,25.95 | R14.1 v47.95,12.05 XU3.5
MMC0.CMD  (via drill 0.35)
  Signal 0.152: v45.75,12.05 45.75,9.45 44.12,7.82 34.56,7.82 31.56,10.82 27.47,10.82 26.18,9.53 25.22,9.53 24.19,10.56 24.19,14.77 17.69,21.27 17.69,24.45 19.19,25.95 v19.35,25.95
  Bottom 0.152: U4.B16 v19.35,25.95 | XU3.3 v45.75,12.05 R15.1
MMC0.D0  (via drill 0.35)
  Signal 0.152: v50.15,12.05 50.15,8.35 49.01,7.21 34.31,7.21 31.31,10.21 27.72,10.21 26.43,8.93 24.96,8.93 23.58,10.31 23.58,14.52 17.08,21.02 17.08,24.93 v19.35,27.2
  Bottom 0.152: U4.A16 18.73,27.82 v19.35,27.2 | R13.1 50.15,20.66 v50.15,12.05 XU3.7
MMC0.D1  (via drill 0.35)
  Signal 0.152: v51.25,13.2 51.25,8.05 50.11,6.91 34.18,6.91 31.18,9.91 27.85,9.91 26.56,8.62 24.84,8.62 23.28,10.18 23.28,14.39 16.78,20.89 16.78,25.41 19.12,27.76 20.09,27.76 v20.65,27.2
  Bottom 0.152: U4.A15 v20.64,27.2 v20.65,27.2 | XU3.8 v51.25,13.2 R12.1
MMC0.D2  (via drill 0.35)
  Signal 0.152: v43.55,13.86 43.55,10.3 41.68,8.43 34.81,8.43 31.81,11.43 27.22,11.43 25.93,10.14 25.47,10.14 24.8,10.81 24.8,15.02 18.3,21.52 18.3,24.2 18.8,24.7 v19.35,24.7
  Bottom 0.152: U4.C16 19.33,24.7 v19.35,24.7 | XU3.1 v43.55,13.86 R17.1
MMC0.D3  (via drill 0.35)
  Signal 0.152: v44.65,14.55 44.65,9.75 43.03,8.13 34.69,8.13 31.69,11.12 27.34,11.12 26.06,9.84 25.34,9.84 24.5,10.69 24.5,14.9 18,21.4 18,24.33 19.02,25.35 20,25.35 v20.65,24.7
  Bottom 0.152: U4.C15 20.6,24.7 v20.65,24.7 | XU3.2 v44.65,14.55 R16.1
NC  (1 unrouted)
NO_GND
  cutout Bottom: 38.55,14.7 38.55,7.85 17.55,7.85 17.55,28.75 38.6,28.75 38.6,19.7 33.95,19.7 33.95,23.4 30.1,23.4 30.1,24.6 27.2,24.6 27.2,23.4 23.3,23.4 23.3,19.5 22.2,19.5 22.2,17 23.1,17 23.1,13.2 26.9,13.2 26.9,11.85 29.6,11.85 29.6,13.3 35.7,13.3 35.7,14.7
OSC_GND
  Bottom 0.152: Y1.2 13.73,21.62 14.45,20.9 14.45,20.75 14.6,20.6 14.6,20.4 15.33,19.67 Y1.4 15.33,14.82 18.2,11.95 19.34,11.95 U4.N15 | Y1.2 13.73,23.52 C7.2 | C6.2 12.58,21.75 Y1.2
PB  (via drill 0.35)
  Signal 0.152: v49.8,38.25 48.23,36.67 48.23,34.42 v46.6,32.8
  Bottom 0.152: S1.3 52.15,38.25 | 52.15,38.25 S1.1 | U1.6 46.1,32.3 v46.6,32.8 | v49.8,38.25 52.15,38.25
PB_V_REF
  Bottom 0.152: U1.3 47.55,33.8 C2.1
PMIC1  (via drill 0.35)
  Signal 0.152: v25.69,13.27 26.37,13.95 38.35,13.95 42.26,17.86 42.26,24.34 42.82,24.91 46.57,24.91 53.14,31.47 53.14,40.45 51.05,42.54 40.3,42.54 37.09,39.33 32.07,39.33 27.95,43.45 27.95,51.45 v31,54.5
  Bottom 0.152: U4.N10 25.69,12.61 | 25.69,12.61 U4.N11 | v25.69,13.27 25.69,12.61 | TP2.TP v31,54.5
PMIC2  (via drill 0.35)
  Bottom 0.15: U4.N5 33.33,12.61 U4.N4
  Bottom 0.152: v33.33,13.24 33.33,12.61
PMIC3  (via drill 0.35)
  Bottom 0.15: U4.M4 33.97,14.51 U4.L4
  Bottom 0.152: v34.58,14.51 33.97,14.51
PMIC4  (via drill 0.35)
  Bottom 0.15: U4.E4 U4.D4
  Bottom 0.152: U4.E4 33.94,22.77 v33.31,22.13
PMIC_MUX
  Bottom 0.152: U4.D7 U4.D6
PMIC_PB  (via drill 0.35)
  VCC 0.152: v43.05,31.8 41.85,30.6 20.85,30.6 v16.5,26.25
  Signal 0.152: v25.7,8.03 25,8.03 22.97,10.06 22.97,14.27 16.47,20.77 16.47,26.22 v16.5,26.25
  Bottom 0.152: U4.T11 25.7,8.17 v25.7,8.03 | U1.8 43.91,32.71 43.53,32.71 43.05,32.23 v43.05,31.8
PMIC_PGOOD  (via drill 0.35)
  Signal 0.152: v25.66,11.97 25.73,12.04 39.03,12.04 42.56,15.57 42.56,24.21 42.89,24.54 46.63,24.54 53.44,31.35 53.44,40.58 51.18,42.84 40.17,42.84 36.97,39.64 32.19,39.64 28.26,43.57 28.26,48.76 v31,51.5
  Bottom 0.152: U4.P11 v25.66,11.97 | TP4.TP v31,51.5 | U4.N12 U4.P11 | U4.P11 24.45,10.71 23.46,10.71 23.2,10.45 23.2,6.87 23,6.67 U5.2
PMIC_TS
  Bottom 0.152: U4.N6 32.05,11.98 32.05,8.25 R1.2
RFID_IRQ  (via drill 0.35)
  Signal 0.152: v34.6,27.2 26.65,27.2 26.27,27.58 26.27,28.69 25.94,29.02 25.48,29.02 25.15,28.69 25.15,27.11 24.49,26.45 23.12,26.45 22.59,26.97 22.59,28.4 20.09,30.9 12.07,30.9 11.31,30.14 4.46,30.14 v2.2,32.4
  Bottom 0.152: v34.6,27.2 U4.B4 | U8.8 2.64,31.45 2.2,31.89 v2.2,32.4
RFID_MISC_1
  Bottom 0.152: C21.2 11.6,42 11.12,41.52 R20.1
RFID_MISC_2
  Bottom 0.152: C22.2 2.08,42.12 2.68,41.52 R21.1
RFID_OSC_IN
  Bottom 0.152: Y2.1 6.2,24.25 C17.1 6.15,26.19 U8.36
RFID_OSC_OUT
  Bottom 0.152: C16.1 Y2.3 5.5,26.35 5.65,26.5 U8.37
RFID_RXN  (via drill 0.35)
  Signal 0.152: v3.5,44.85 4.35,44.85 5.89,43.31 5.89,36.26 v5.95,36.2
  Bottom 0.152: U8.15 6.15,36 v5.95,36.2 | v3.5,44.85 C22.1
RFID_RXP  (via drill 0.35)
  Signal 0.152: v6.85,36.2 7.01,36.36 7.01,43.3 8.56,44.85 v10.2,44.85
  Bottom 0.152: U8.16 6.65,36 v6.85,36.2 | v10.2,44.85 C21.1
RFID_TX1
  Bottom 0.152: L1.1 8.77,36.75 9.45,36.07 U8.21
RFID_TX2
  Bottom 0.152: L2.1 5.35,37.71 5.84,37.23 8.09,37.23 8.46,36.85 8.46,36.62 8.8,36.28 8.8,34.75 8.45,34.4 8.1,34.4 7.65,33.95 U8.18
RFID_VEN  (via drill 0.35)
  Signal 0.152: v2.2,33.25 2.2,33.19 1.64,32.63 1.64,19.45 3.96,17.14 18.75,17.14 22.46,13.43 22.46,8.69 23.68,7.47 25.93,7.47 27.81,9.35 v30.8,9.35
  Bottom 0.152: U8.10 3,32.45 v2.2,33.25 TP16.TP | v30.8,9.35 30.87,9.35 U4.T6
RTC_1P8  (via drill 0.35)
  Signal 0.152: v25.7,15.75 29.01,15.75 34,20.75 34,21.05 34.37,21.42 36.82,21.42 38.1,22.7 38.1,24.25 36.58,25.77 36.58,27.44 37.18,28.03 42.97,28.03 44.85,29.92 v44.85,31.7 44.6,31.95 44.6,35.88 42.36,38.12 29.18,38.12 21.99,45.31 21.99,53.49 v26,57.5
  Bottom 0.15: U5.6
  Bottom 0.152: C5.1 20.25,7.03 U5.6 21.45,7.95 21.9,8.4 21.9,10.55 22.09,10.74 23.06,10.74 23.15,10.83 23.15,12.95 23.4,13.2 23.95,13.2 24.45,13.7 24.45,14.52 U4.L11 | U4.L11 U4.K11 | U1.4 45.05,33.3 44.85,33.1 v44.85,31.7 | v25.7,15.75 25.68,15.75 U4.L11 | v26,57.5 TP9.TP
SIP_OSC_IN
  Bottom 0.152: C6.1 12.59,19.56 Y1.1 13.73,15.22 17.61,11.34 U4.P16
SIP_OSC_OUT
  Bottom 0.152: C7.1 15.33,23.52 Y1.3 16.88,20.21 16.88,14.45 U4.N16
SYS_VDD2_3P3V  (via drill 0.35)
  VCC 0.152: v24.44,20.83 23.91,20.3 15.81,20.3 8.28,27.84 3.38,27.84 1.64,29.57 1.64,38.5 14.65,51.5 v16,51.5
  Bottom 0.152: TP8.TP v16,51.5 | U4.F11 24.44,20.86 v24.44,20.83
  Bottom 0.2: U4.F11 U4.G11
SYS_VDD3_3P3V  (via drill 0.35)
  VCC 0.152: v28.25,18.32 26.38,16.45 5.72,16.45 1.03,21.13 1.03,38.75 15.14,52.85 15.14,56.64 v16,57.5
  Bottom 0.152: TP10.TP v16,57.5
  Bottom 0.2: U4.J7 U4.J8 | U4.H7 U4.H8
  pour Bottom: 29.3,14.77 27.2,14.77 27.2,21.82 29.3,21.82
SYS_VDD_1P8V  (via drill 0.35)
  VCC 0.152: v25.71,18.32 24.15,16.76 5.84,16.76 1.34,21.26 1.34,38.62 15.44,52.73 15.44,53.94 v16,54.5
  Bottom 0.152: TP11.TP v16,54.5
  pour Bottom: 26.6,14.62 26.6,21.87 26.05,21.87 26.05,19.27 24.9,19.27 24.9,17.37 26.05,17.37 26.05,14.62
SYS_VOUT  (via drill 0.35)
  Signal 0.152: v30.77,15.78 31.31,16.33 37.38,16.33 41.95,20.9 41.95,24.46 42.7,25.21 46.44,25.21 52.83,31.6 52.83,40.33 50.93,42.23 40.42,42.23 37.22,39.03 31.94,39.03 27.65,43.32 27.65,54.15 v31,57.5
  Bottom 0.152: TP6.TP v31,57.5
  pour Bottom: 31.55,14.82 29.9,14.82 29.9,16.62 31.55,16.62
TP_IRQ  (via drill 0.35)
  Signal 0.152: v35.85,22.1 33.97,23.98 22.18,23.98 21.21,24.95 21.21,28.06 20.47,28.8 18.26,28.8 15.6,26.14 15.6,24.95 15.08,24.43 13.52,24.43 10.7,21.6 v10.7,19.15
  Bottom 0.152: 10.38,20.48 11,21.1 11,22.55 11.25,22.8 R8.1 | 10.38,20.48 XU1.1 | 10.38,20.48 10.7,20.15 v10.7,19.15 | v35.85,22.1 36.45,21.5 U4.F2
TPM_SCL
  Bottom 0.152: U6.29 47.33,28.76 46.12,29.97 42.55,29.97 | 26.25,27.94 U4.A10 25.7,27.2 25.7,26.39 26.17,25.92 26.68,25.92 26.95,25.66 26.95,25 27.3,24.65 31.8,24.65 32.05,24.9 32.05,28.1 33.92,29.97 42.55,29.97 | R19.2 42.55,29.97
TPM_SDA
  Bottom 0.152: U6.30 47.73,28.82 | 47.73,28.82 46.52,30.02 46.5,30.02 46.25,30.27 32.52,30.27 30.8,28.55 30.8,26.2 30.5,25.9 27.35,25.9 26.68,26.57 U4.B10 | 47.73,28.82 48.48,28.82 48.77,29.11 50.17,29.11 R18.2
UART0_RX
  Bottom 0.152: U4.A12 23.8,29.05 25.87,31.12 45.97,31.12 47.45,32.6 J3.2
UART0_TX
  Bottom 0.152: U4.B12 23.8,26.61 24.43,27.23 24.43,28.77 26.46,30.82 46.37,30.82 47.15,31.6 J3.3
UART.RX_SIP.TX
  Bottom 0.152: U3.2 10.35,7 11.25,7.9 11.25,9.35 11.96,10.07 U4.R16
UART.TX_SIP.RX
  Bottom 0.152: U4.P15 19.36,10.7 8.7,10.7 7.7,9.7 U3.30
UART_3V3  (via drill 0.35)
  Signal 0.152: v2.8,4.65 8.2,4.65 10.3,6.75 v10.3,8.4
  Bottom 0.152: U3.16 4,3.45 v2.8,4.65 2.8,5.87 C4.1 | v10.3,8.4 10.3,7.9 9.9,7.5 U3.1
USB+  (via drill 0.35)
  Signal 0.152: v10.6,3.7 11.95,3.7 12.1,3.85 12.1,4.9 12.25,5.05 12.5,5.05 12.65,4.9 12.65,3.85 12.8,3.7 13.05,3.7 13.2,3.85 13.2,4.9 13.35,5.05 13.6,5.05 13.75,4.9 13.75,3.85 13.9,3.7 14.15,3.7 14.3,3.85 14.3,4.9 14.45,5.05 14.7,5.05 14.85,4.9 14.85,3.85 15,3.7 15.25,3.7 15.4,3.85 15.4,4.9 15.55,5.05 15.8,5.05 15.95,4.9 15.95,3.85 16.1,3.7 16.35,3.7 16.5,3.85 16.5,4.9 16.65,5.05 23.5,5.05 24.7,6.25 v26.2,6.25
  Bottom 0.152: v10.6,3.7 9.73,2.83 6.42,2.83 6.2,3.05 U3.14 | v26.2,6.25 27.33,5.12 J2.3
USB-  (via drill 0.35)
  Signal 0.152: v2.8,3.75 8.5,3.75 10.79,6.04 24.06,6.04 24.82,6.81 26.89,6.81 v27.45,6.25
  Bottom 0.152: v2.8,3.75 2.8,3.38 3.35,2.83 5.48,2.83 5.7,3.05 U3.15 | v27.45,6.25 27.98,5.72 J2.2
USR0  (via drill 0.35)
  Signal 0.152: v21.9,11.97 21.34,12.53 20.4,12.53 18.2,10.32 10.34,10.32 1.34,19.33 1.34,33.18 2.05,33.89 7.27,33.89 10.72,30.44 11.18,30.44 11.51,30.77 11.51,31.34 9.63,33.22 9.63,36.53 14.49,41.4 14.49,53.51 v11,57
  Bottom 0.152: D2.A v11,57 | v21.9,11.97 U4.P13
USR1  (via drill 0.35)
  Signal 0.152: v20.63,9.41 9.96,9.41 0.42,18.95 0.42,36.83 1.65,38.05 4.7,38.05 5.39,37.36 5.39,35.97 5.72,35.64 7.44,35.64 13.57,41.77 13.57,46.92 v11,49.5
  Bottom 0.152: U4.T14 v20.63,9.41 | D3.A v11,49.5
USR2  (via drill 0.35)
  Signal 0.152: v20.63,10.68 19.66,9.71 10.09,9.71 0.73,19.07 0.73,36.7 1.78,37.74 4.57,37.74 5.09,37.23 5.09,35.84 5.59,35.34 7.57,35.34 13.88,41.65 13.88,49.12 v11,52
  Bottom 0.152: U4.R14 v20.63,10.68 | D4.A v11,52
USR3  (via drill 0.35)
  Signal 0.152: v20.63,11.97 18.68,10.02 10.22,10.02 1.03,19.2 1.03,36.57 1.9,37.44 4.45,37.44 4.78,37.1 4.78,35.72 5.47,35.03 7.7,35.03 14.18,41.52 14.18,51.32 v11,54.5
  Bottom 0.152: U4.P14 v20.63,11.97 | D5.A v11,54.5
VDD
  pour Bottom: 12.33,29.08 12.33,27.86 9.11,27.86 9.11,29.08
VDD(MID)
  Bottom 0.152: C30.1 7.15,34.34 U8.17
VDD(TX)  (via drill 0.35)
  Signal 0.152: v2.75,36.65 2.75,35.5 4.06,34.19 7.76,34.19 v10.95,31
  Bottom 0.152: C29.1 14.9,29.65 14.04,30.51 11.44,30.51 v10.95,31 10.95,31.6 10.6,31.95 U8.22 | U8.14 5.65,35.71 4.71,36.65 v2.75,36.65
VDD_CORE  (via drill 0.35)
  Signal 0.152: v34.6,20.86 39.11,20.86 41.65,23.4 41.65,24.59 42.48,25.42 42.48,26.07 42.81,26.39 46.05,26.39 52.53,32.87 52.53,40.2 50.8,41.93 40.55,41.93 37.35,38.73 29.44,38.73 22.6,45.56 22.6,48.1 v26,51.5
  Bottom 0.152: TP13.TP v26,51.5 | v34.6,20.86 U4.G4
VDD_MPU  (via drill 0.35)
  VCC 0.152: v21.9,22.13 15.99,22.13 9.67,28.45 8.32,28.45 3.4,33.37 3.4,36.9 v21,54.5
  Bottom 0.152: TP14.TP v21,54.5 | U4.F13 v21.9,22.13
VDDS_DDR  (via drill 0.35)
  VCC 0.152: v34.58,24.67 34.05,24.14 17.82,24.14 13.21,28.75 8.45,28.75 3.7,33.5 3.7,36.77 18.43,51.5 v21,51.5
  Bottom 0.152: v21,51.5 TP12.TP | v34.58,24.67 34.58,22.11 U4.F4
VDDS_PLL  (via drill 0.35)
  VCC 0.152: v21.9,20.86 16.83,20.86 9.55,28.14 8.2,28.14 2.19,34.14 2.19,38.62 10.97,47.39 12.71,47.39 19.56,54.24 19.56,56.06 v21,57.5
  Bottom 0.152: TP15.TP v21,57.5 | U4.G13 v21.9,20.86
VIN_AC
  Bottom 0.15: U4.P10 U4.R10 U4.T10
VIN_BAT  (via drill 0.35)
  Signal 0.152: v50,36.85 50,37.66 50.36,38.02 50.36,40.02 48.75,41.62 40.67,41.62 37.47,38.42 29.31,38.42 22.3,45.44 22.3,50.8 v26,54.5
  Bottom 0.15: U4.N7 U4.P8
  Bottom 0.152: C19.1 13.4,29.4 12.85,29.95 v12.05,29.95 U8.26 | U2.A1 49.65,37.2 v50,36.85 | v26,54.5 TP1.TP
  Bottom 0.254: U4.P8 U4.R8 U4.T8 28.89,7.96 v30.5,6.35
  other vias: 4.9,34.75 31.95,6.35 49.35,36.05
  pour Bottom: 5.35,35.2 5.35,32.9 3.34,32.93 3.34,35.23
  pour Bottom: 32.53,7.05 32.53,5.8 29.88,5.8 29.88,7.05
  pour Bottom (no thermals): 47.8,37.2 50.35,37.2 50.35,35.55 49.1,35.55
  pour VCC: 51,35.8 49.4,35.8 49.35,37.2 53.6,37.2 53.6,4.6 29.9,4.6 29.9,6.85 48.65,6.85 51.25,9.35 51.25,35.55
  pour VCC (rank 3): 11.5,30.9 12.5,30.9 13.05,30.35 13.05,29.65 12.55,29.15 8.6,29.15 4.05,33.7 4.05,35.9 14.15,46 48.75,46 51.8,42.95 51.8,37 50.35,35.75 49.2,35.75 48.85,36.1 48.85,40.45 46.15,43.25 16.55,43.25 10.8,37.35 10.8,31.6
VIN_USB  (via drill 0.35)
  Signal 0.152: v2.75,8.85 2.86,8.96 15,8.96 16.84,7.12 23.48,7.12 23.52,7.16 27.72,7.16 v28.63,6.25
  Bottom 0.15: U3.18 U3.19
  Bottom 0.152: 4.71,5.06 U3.19 4.1,5 3.7,5.4 3.7,6.8 3.06,7.44 C3.1 v2.75,8.85 | v49.1,34.7 49.1,34.05 J3.1 50.1,34.15 v50.1,34.7
  Bottom 0.254: J2.1 v28.63,6.25 28.63,6.57 v28.05,7.15 27.61,7.58 U4.T9 U4.R9 U4.P9
  pour Bottom (no thermals): 48.7,35.15 50.45,35.15 50.45,33.35 48.7,33.35
  pour VCC (rank 2): 29,5.55 28.5,5.55 27.35,6.7 27.35,7.5 30.2,10.35 38.85,10.35 48,19.5 48,34.7 48.6,35.3 50.55,35.3 50.55,15.7 42.25,7.4 29.55,7.4 29,6.85

### Text on the board
tPlace: Cypher v0.3 / © 2018 Megahash Corp | www.megahash.us